# Altium project EVMOMAPL137_Orcad_revg.PrjPcb (part 2 of 4)

## Sheet SH21 - JTAG CONNECTOR.SchDoc
size 386 x 246 mm
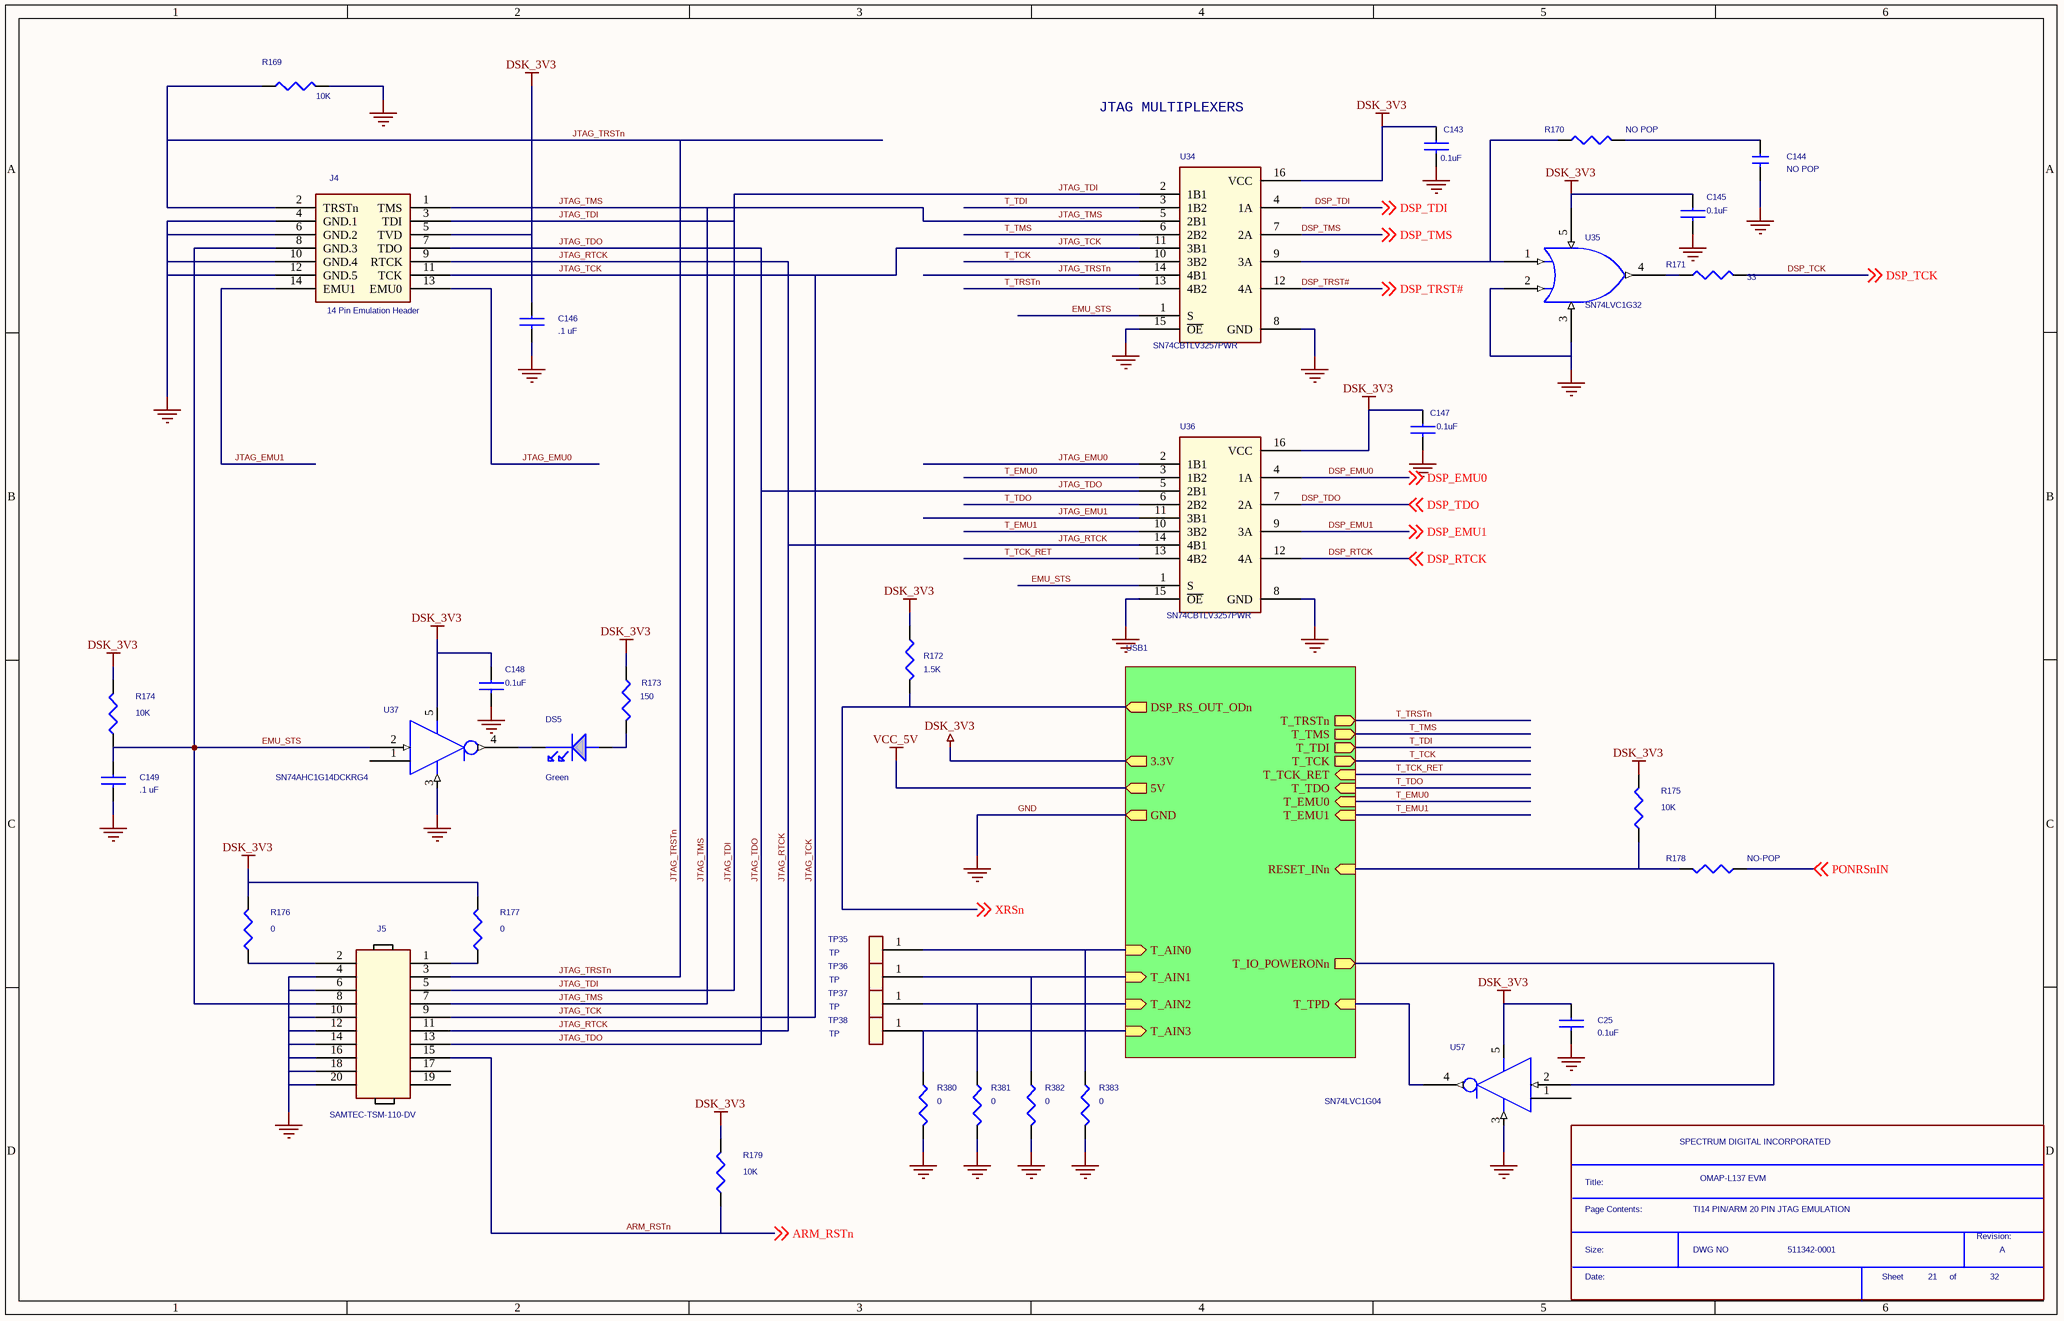
[diagram p11: SH21 - JTAG CONNECTOR.SchDoc]

### Parts
(Parts that share a designator on the sheet are numbered #1, #2 ... from top to bottom, then left to right.)
*#12  Page Contents:: TI14 PIN/ARM 20 PIN JTAG EMULATION  RevCode: A  Title: OMAP-L137 EVM  OrgName: SPECTRUM DIGITAL INCORPORATED  Doc: 511342-0001  Page Number: 21  Page Count: 32  (hidden comment: SDTitleBlock)  (graphical)
C25  0.1uF  [c402-25]
C143  0.1uF  [c402-25]
C144  NO POP  [c402-25]
C145  0.1uF  [c402-25]
C146  .1 uF  [c402-25]
C147  0.1uF  [c402-25]
C148  0.1uF  [c402-25]
C149  .1 uF  [c402-25]
DS5  Green  [CHIP 1206]
J4  14 Pin Emulation Header  [JUMP2X7-6040]
J5  SAMTEC-TSM-110-DV  [JUMP2X10-6040]
R169  10K  [r402-25]
R170  NO POP  [r603-35X45]
R171  33  [r402-25]
R172  1.5K  [r603-35x45]
R173  150  [r603-35x45]
R174  10K  [r402-25]
R175  10K  [r402-25]
R176  0  [r402-25]
R177  0  [r402-25]
R178  NO-POP  [r402-25]
R179  10K  [r402-25]
R380  0  [r402-25]
R381  0  [r402-25]
R382  0  [r402-25]
R383  0  [r402-25]
TP35  TP  [tp1-6040]
TP36  TP  [tp1-6040]
TP37  TP  [tp1-6040]
TP38  TP  [tp1-6040]
U34  SN74CBTLV3257PWR  [TSSOP 16]
U35  SN74LVC1G32  [SO5]
U36  SN74CBTLV3257PWR  [TSSOP 16]
U37  SN74AHC1G14DCKRG4  [DCK]
U57  SN74LVC1G04  [DCK]

### Sub-sheets
USB1 = ?: GND (out), 3.3V (out), T_TCK_RET (in), T_TCK (out), T_TMS (out), T_TDI (out), T_TDO (in), T_EMU0 (in), T_EMU1 (in), T_TRSTn (out), DSP_RS_OUT_ODn (out), RESET_INn (in), 5V (out), T_IO_POWERONn (out), T_TPD (in), T_AIN0 (in), T_AIN1 (in), T_AIN2 (in), T_AIN3 (in)

### Nets
DSK_3V3: C25.1 C143.1 C145.1 C146.1 C147.1 C148.1 J4.5(TVD) R172.1 R173.1 R174.2 R175.2 R176.2 R177.2 R179.2 U34.16(VCC) U35.5(VCC) U36.16(VCC) U37.5(VCC) U57.5(VCC) ; sheet USB1/3.3V
GND: C25.2 C143.2 C144.2 C145.2 C146.2 C147.2 C148.2 C149.2 J4.4(GND.1) J4.6(GND.2) J4.10(GND.4) J4.12(GND.5) J5.4 J5.6 J5.10 J5.12 J5.14 J5.16 J5.18 J5.20 R169.2 R380.2 R381.2 R382.2 R383.2 U34.8(GND) U34.15(~{OE}) U35.2(A) U35.3(GND) U36.8(GND) U36.15(~{OE}) U37.3(GND) U57.3(GND) ; sheet USB1/GND
ARM_RSTn: J5.15 R179.1 ; off-sheet ARM_RSTn
DSP_EMU0: U36.4(1A) ; off-sheet DSP_EMU0
DSP_EMU1: U36.9(3A) ; off-sheet DSP_EMU1
DSP_RTCK: U36.12(4A) ; off-sheet DSP_RTCK
DSP_TCK: R171.1 ; off-sheet DSP_TCK
DSP_TDI: U34.4(1A) ; off-sheet DSP_TDI
DSP_TDO: U36.7(2A) ; off-sheet DSP_TDO
DSP_TMS: U34.7(2A) ; off-sheet DSP_TMS
DSP_TRST#: U34.12(4A) ; off-sheet DSP_TRST#
EMU_STS: C149.1 J4.8(GND.3) J5.8 R174.1 U34.1(S) U36.1(S) U37.2(I)
JTAG_EMU0: J4.13(EMU0) U36.2(1B1)
JTAG_EMU1: J4.14(EMU1) U36.11(3B1)
JTAG_RTCK: J4.9(RTCK) J5.11 U36.14(4B1)
JTAG_TCK: J4.11(TCK) J5.9 U34.11(3B1)
JTAG_TDI: J4.3(TDI) J5.5 U34.2(1B1)
JTAG_TDO: J4.7(TDO) J5.13 U36.5(2B1)
JTAG_TMS: J4.1(TMS) J5.7 U34.5(2B1)
JTAG_TRSTn: J4.2(TRSTn) J5.3 R169.1 U34.14(4B1)
PONRSnIN: R178.1 ; off-sheet PONRSnIN
T_EMU0: U36.3(1B2) ; sheet USB1/T_EMU0
T_EMU1: U36.10(3B2) ; sheet USB1/T_EMU1
T_TCK: U34.10(3B2) ; sheet USB1/T_TCK
T_TCK_RET: U36.13(4B2) ; sheet USB1/T_TCK_RET
T_TDI: U34.3(1B2) ; sheet USB1/T_TDI
T_TDO: U36.6(2B2) ; sheet USB1/T_TDO
T_TMS: U34.6(2B2) ; sheet USB1/T_TMS
T_TRSTn: U34.13(4B2) ; sheet USB1/T_TRSTn
XRSn: R172.2 ; off-sheet XRSn, sheet USB1/DSP_RS_OUT_ODn
NetC144_1: C144.1 R170.2
NetDS5_1: DS5.1(CATHODE) U37.4(O)
NetDS5_2: DS5.2(ANODE) R173.2
NetJ5_1: J5.1 R177.1
NetJ5_2: J5.2 R176.1
NetR170_1: R170.1 U34.9(3A) U35.1(B)
NetR171_2: R171.2 U35.4(Y)
NetR175_1: R175.1 R178.2 ; sheet USB1/RESET_INn
NetR380_1: R380.1 TP38.1 ; sheet USB1/T_AIN3
NetR381_1: R381.1 TP37.1 ; sheet USB1/T_AIN2
NetR382_1: R382.1 TP36.1 ; sheet USB1/T_AIN1
NetR383_1: R383.1 TP35.1 ; sheet USB1/T_AIN0
NetU57_2: U57.2(I) ; sheet USB1/T_IO_POWERONn
NetU57_4: U57.4(O) ; sheet USB1/T_TPD

Not connected (* = marked no-connect by the designer): J5 17 19; U37 1; U57 1

### Notes on the sheet
- JTAG MULTIPLEXERS
- (in symbol SDTitleBlock) Title:; Page Contents:; Revision:; Size:; DWG NO; Date:; Sheet; of

### Library data of the parts
C25 = CAP NP: Part #: 101587-1100R
C143 C145 C147 C148 = CAP NP_0: Capacitor, Ceramic, 16V, X7R, 10%; Part #: 101587-1100R
C144 = CAP NP_1: Part #: C0402-NOPOP
C146 C149 = CAP NP_0: Part #: 101587-1100R
DS5 = LED_1: LED, Green, SMT; Part #: 100823-0001R
J4 = 14 Pin Emulation Header_1: Part #: 100116-0007R
J5 = HEADER 10X2: Part #: 100116-0010R; TN: 224-0183-000
R169 R174 R175 R179 = RESISTOR_1: Part #: 101370-1003R
R170 = R: Part #: R0603-NOPOP
R171 = R_1: Resistor, 5%, 1/16W; Part #: 101370-3300R
R172 = RESISTOR_1: Part #: 100642-1502R
R173 = R_1: Resistor, 5%, 1/16W; Part #: 100687-1501R
R176 R177 R380-R383 = R: Part #: 101370-0001R
R178 = RESISTOR_1: Part #: R0402-NOPOP
TP35-TP38 = TEST POINT: Part #: 100115-0001R
U34 U36 = SN74CBT3257_0: IC, Quad 2-1 Multiplexer; Part #: 101670-0001R
U35 = 1G032_0: Part #: 101057-0032R
U37 = SN74LVC1GU04_0: Single Schmitt-Trigger Inverter Gate; Part #: 101027-0001R
U57 = SN74LVC1GU04_0: Part #: 101057-0004R

## Sheet SH20 - SD_MMC.SchDoc
size 386 x 246 mm
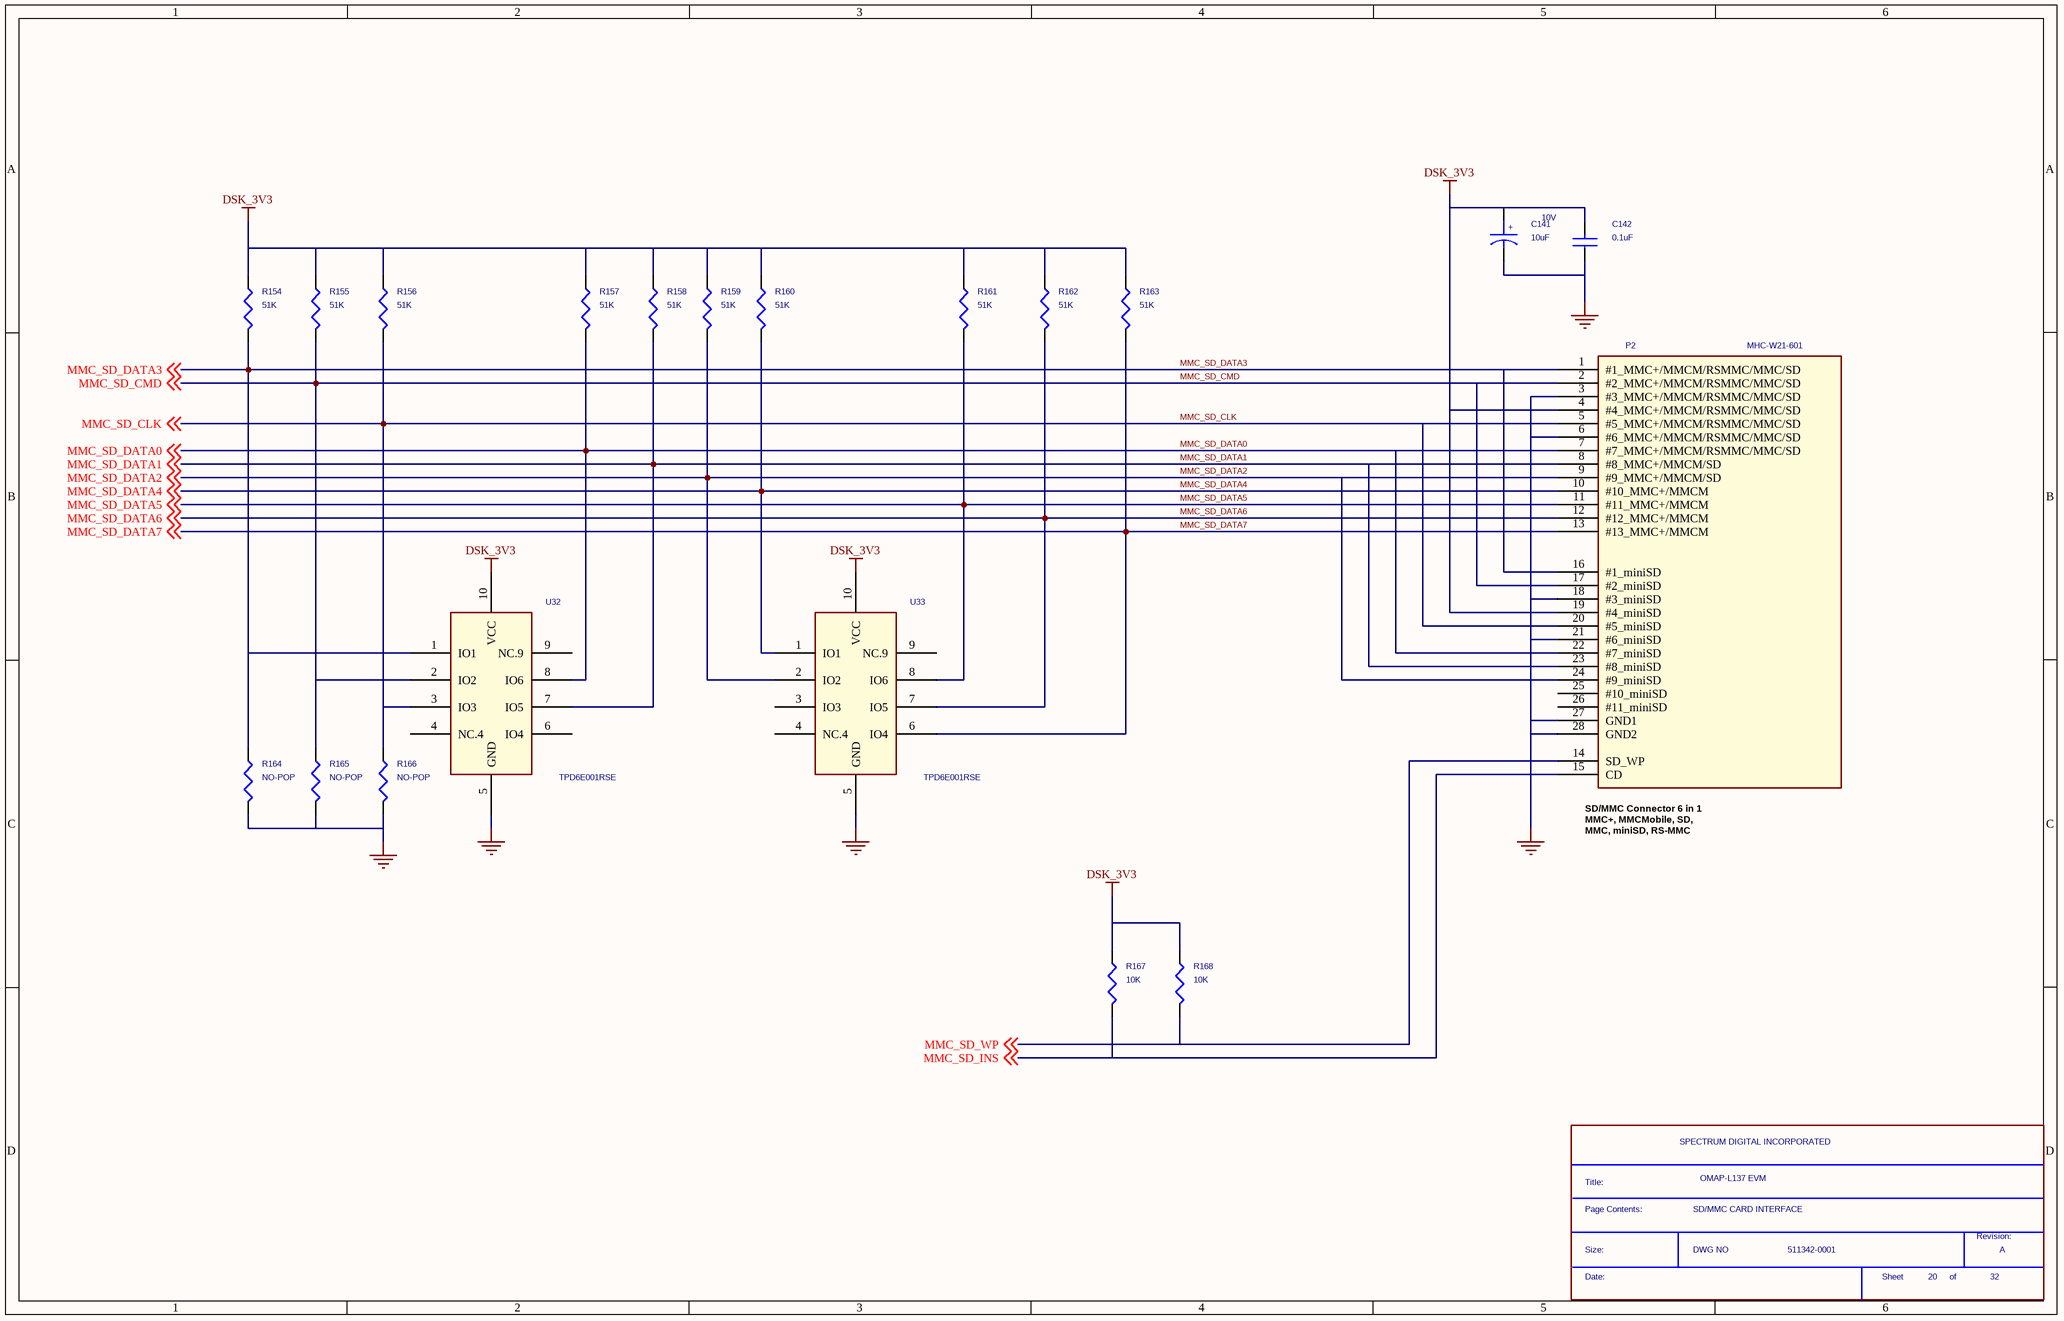
[diagram p12: SH20 - SD_MMC.SchDoc]

### Parts
(Parts that share a designator on the sheet are numbered #1, #2 ... from top to bottom, then left to right.)
*#13  Page Contents:: SD/MMC CARD INTERFACE  RevCode: A  Title: OMAP-L137 EVM  OrgName: SPECTRUM DIGITAL INCORPORATED  Doc: 511342-0001  Page Number: 20  Page Count: 32  (hidden comment: SDTitleBlock)  (graphical)
C141  10uF  [SM-PCAP-3216]
C142  0.1uF  Voltage: 10V  [SM-CAP-0402]
P2  MHC-W21-601  [SM-CON-MOLEX-54794-0918]
R154  51K  [r603-35X45]
R155  51K  [r603-35X45]
R156  51K  [r603-35X45]
R157  51K  [r603-35X45]
R158  51K  [r603-35X45]
R159  51K  [r603-35X45]
R160  51K  [r603-35X45]
R161  51K  [r603-35X45]
R162  51K  [r603-35X45]
R163  51K  [r603-35X45]
R164  NO-POP  [r402-25]
R165  NO-POP  [r402-25]
R166  NO-POP  [r402-25]
R167  10K  [SM-RES-0402]
R168  10K  [SM-RES-0402]
U32  TPD6E001RSE  [rse10]
U33  TPD6E001RSE  [rse10]

### Nets
DSK_3V3: C141.1(P) C142.2 P2.4(#4_MMC+/MMCM/RSMMC/MMC/SD) P2.19(#4_miniSD) R154.1 R155.1 R156.1 R157.1 R158.1 R159.1 R160.1 R161.1 R162.1 R163.1 R167.2(P2) R168.2(P2) U32.10(VCC) U33.10(VCC)
GND: C141.2(M) C142.1 P2.3(#3_MMC+/MMCM/RSMMC/MMC/SD) P2.6(#6_MMC+/MMCM/RSMMC/MMC/SD) P2.18(#3_miniSD) P2.21(#6_miniSD) P2.27(GND1) P2.28(GND2) R164.2 R165.2 R166.2 U32.5(GND) U33.5(GND)
MMC_SD_CLK: P2.5(#5_MMC+/MMCM/RSMMC/MMC/SD) P2.20(#5_miniSD) R156.2 R166.1 U32.3(IO3) ; off-sheet MMC_SD_CLK
MMC_SD_CMD: P2.2(#2_MMC+/MMCM/RSMMC/MMC/SD) P2.17(#2_miniSD) R155.2 R165.1 U32.2(IO2) ; off-sheet MMC_SD_CMD
MMC_SD_DATA0: P2.7(#7_MMC+/MMCM/RSMMC/MMC/SD) P2.22(#7_miniSD) R157.2 U32.8(IO6) ; off-sheet MMC_SD_DATA0
MMC_SD_DATA1: P2.8(#8_MMC+/MMCM/SD) P2.23(#8_miniSD) R158.2 U32.7(IO5) ; off-sheet MMC_SD_DATA1
MMC_SD_DATA2: P2.9(#9_MMC+/MMCM/SD) P2.24(#9_miniSD) R159.2 U33.2(IO2) ; off-sheet MMC_SD_DATA2
MMC_SD_DATA3: P2.1(#1_MMC+/MMCM/RSMMC/MMC/SD) P2.16(#1_miniSD) R154.2 R164.1 U32.1(IO1) ; off-sheet MMC_SD_DATA3
MMC_SD_DATA4: P2.10(#10_MMC+/MMCM) R160.2 U33.1(IO1) ; off-sheet MMC_SD_DATA4
MMC_SD_DATA5: P2.11(#11_MMC+/MMCM) R161.2 U33.8(IO6) ; off-sheet MMC_SD_DATA5
MMC_SD_DATA6: P2.12(#12_MMC+/MMCM) R162.2 U33.7(IO5) ; off-sheet MMC_SD_DATA6
MMC_SD_DATA7: P2.13(#13_MMC+/MMCM) R163.2 U33.6(IO4) ; off-sheet MMC_SD_DATA7
MMC_SD_INS: P2.15(CD) R167.1(P1) ; off-sheet MMC_SD_INS
MMC_SD_WP: P2.14(SD_WP) R168.1(P1) ; off-sheet MMC_SD_WP

Not connected (* = marked no-connect by the designer): P2 25(#10_miniSD) 26(#11_miniSD); U32 4(NC.4) 6(IO4) 9(NC.9); U33 3(IO3) 4(NC.4) 9(NC.9)

### Notes on the sheet
- (near P2) SD/MMC Connector 6 in 1
  MMC+, MMCMobile, SD,
  MMC, miniSD, RS-MMC
- (in symbol 10UF-10V-293D-C_1) +
- (in symbol SDTitleBlock) Title:; Page Contents:; Revision:; Size:; DWG NO; Date:; Sheet; of

### Library data of the parts
C141 = 10UF-10V-293D-C_1: Part #: 101003-0101R; CLASS: DISCRETE; DIS-V: RS; REF DIS-V: 100-2221; MAN: VISHAY-SPRAGUE; DES: 10UF,10V, Size B; PN: 293D106X9016C; RAT: 10V; PUR: SUB; TOL: 10%; TN: 208-0037-000
C142 = 0402_0r1uf_x7r_10v_10: Part #: 101587-1100R; TN: 207-0068-000; Desc: CAP, CER, X7R, 0402, 10V, 10%, 0.1uF
P2 = MMC4_2.0_CONN: Manufacturer: OMRON; Part #: 102710-0001R; ATLStockNo1: 4500.0144; TN: 224-0332-000
R154-R163 = R_1: Part #: 100687-5103R
R164-R166 = R_1: Part #: R0402-NOPOP
R167 R168 = RES_0: Part #: 101370-1003R; CLASS: DISCRETE; TN: 272-0029-000; TOL: 1%; RATING: 0.063W
U32 U33 = TPDE0001RSE: Part #: 102566-0001R

## Sheet SH19 - SD_MMC MUX.SchDoc
size 386 x 246 mm
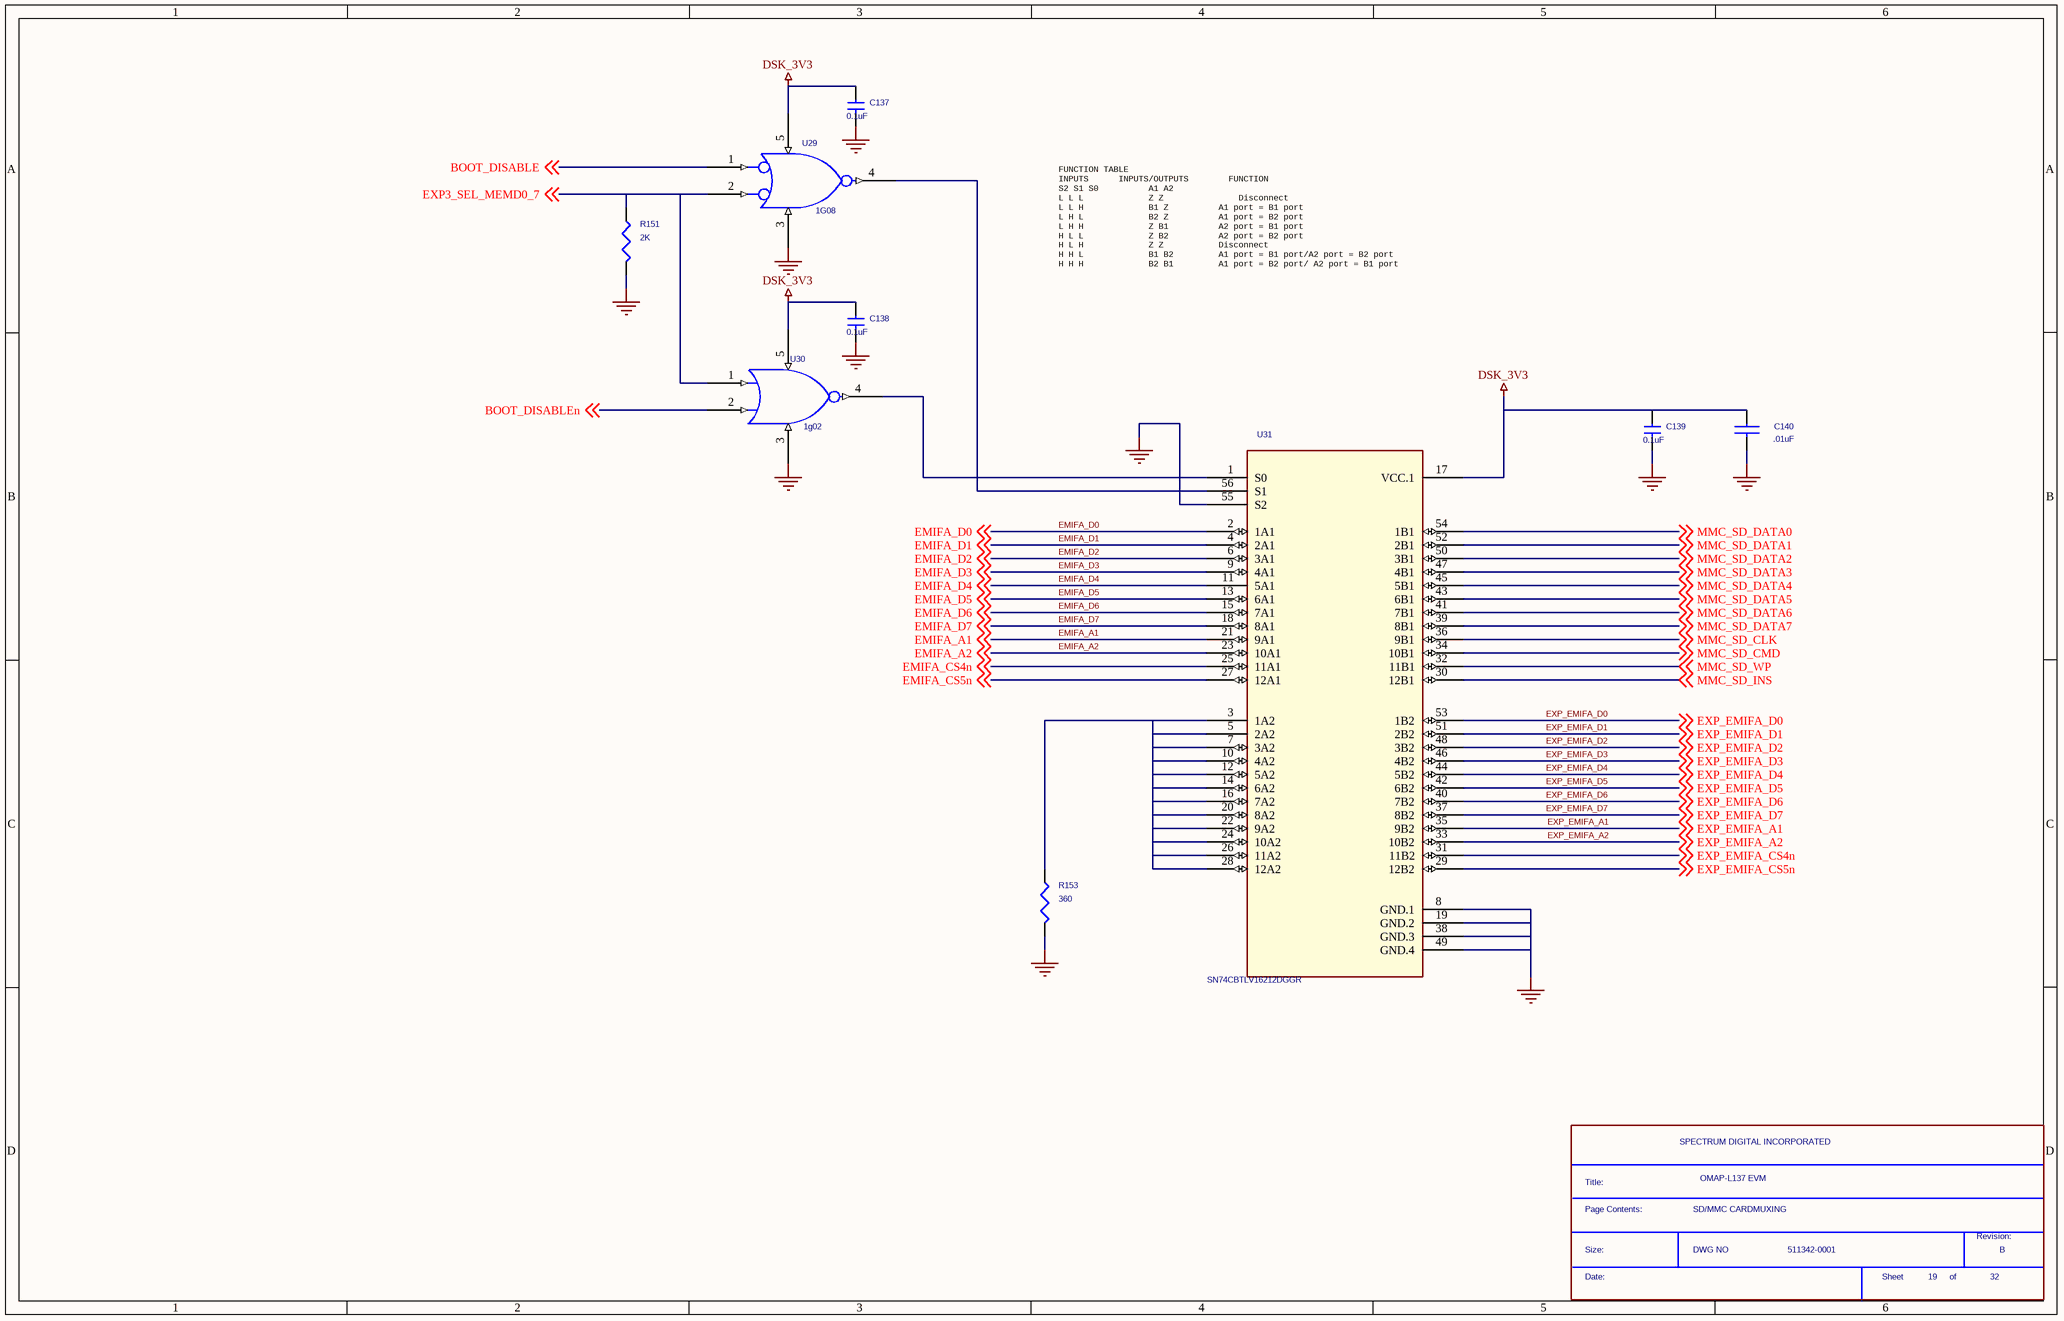
[diagram p13: SH19 - SD_MMC MUX.SchDoc]

### Parts
(Parts that share a designator on the sheet are numbered #1, #2 ... from top to bottom, then left to right.)
*#14  Page Contents:: SD/MMC CARDMUXING  RevCode: B  Title: OMAP-L137 EVM  OrgName: SPECTRUM DIGITAL INCORPORATED  Doc: 511342-0001  Page Number: 19  Page Count: 32  (hidden comment: SDTitleBlock)  (graphical)
C137  0.1uF  [c402-25]
C138  0.1uF  [c402-25]
C139  0.1uF  [c402-25]
C140  .01uF  [c402-25]
R151  2K  [r402-25]
R153  360  [r402-25]
U29  1G08  [SO5]
U30  1g02  [dck-5]
U31  SN74CBTLV16212DGGR  [56 pin TSSOP]

### Nets
DSK_3V3: C137.1 C138.1 C139.1 C140.1 U29.5(VCC) U30.5(VCC) U31.17(VCC.1)
GND: C137.2 C138.2 C139.2 C140.2 R151.2 R153.2 U29.3(GND) U30.3(GND) U31.8(GND.1) U31.19(GND.2) U31.38(GND.3) U31.49(GND.4) U31.55(S2)
BOOT_DISABLE: U29.1(B) ; off-sheet BOOT_DISABLE
BOOT_DISABLEn: U30.2(A) ; off-sheet BOOT_DISABLEn
EMIFA_A1: U31.21(9A1) ; off-sheet EMIFA_A1
EMIFA_A2: U31.23(10A1) ; off-sheet EMIFA_A2
EMIFA_CS4n: U31.25(11A1) ; off-sheet EMIFA_CS4n
EMIFA_CS5n: U31.27(12A1) ; off-sheet EMIFA_CS5n
EMIFA_D0: U31.2(1A1) ; off-sheet EMIFA_D0
EMIFA_D1: U31.4(2A1) ; off-sheet EMIFA_D1
EMIFA_D2: U31.6(3A1) ; off-sheet EMIFA_D2
EMIFA_D3: U31.9(4A1) ; off-sheet EMIFA_D3
EMIFA_D4: U31.11(5A1) ; off-sheet EMIFA_D4
EMIFA_D5: U31.13(6A1) ; off-sheet EMIFA_D5
EMIFA_D6: U31.15(7A1) ; off-sheet EMIFA_D6
EMIFA_D7: U31.18(8A1) ; off-sheet EMIFA_D7
EXP3_SEL_MEMD0_7: R151.1 U29.2(A) U30.1(B) ; off-sheet EXP3_SEL_MEMD0_7
EXP_EMIFA_A1: U31.35(9B2) ; off-sheet EXP_EMIFA_A1
EXP_EMIFA_A2: U31.33(10B2) ; off-sheet EXP_EMIFA_A2
EXP_EMIFA_CS4n: U31.31(11B2) ; off-sheet EXP_EMIFA_CS4n
EXP_EMIFA_CS5n: U31.29(12B2) ; off-sheet EXP_EMIFA_CS5n
EXP_EMIFA_D0: U31.53(1B2) ; off-sheet EXP_EMIFA_D0
EXP_EMIFA_D1: U31.51(2B2) ; off-sheet EXP_EMIFA_D1
EXP_EMIFA_D2: U31.48(3B2) ; off-sheet EXP_EMIFA_D2
EXP_EMIFA_D3: U31.46(4B2) ; off-sheet EXP_EMIFA_D3
EXP_EMIFA_D4: U31.44(5B2) ; off-sheet EXP_EMIFA_D4
EXP_EMIFA_D5: U31.42(6B2) ; off-sheet EXP_EMIFA_D5
EXP_EMIFA_D6: U31.40(7B2) ; off-sheet EXP_EMIFA_D6
EXP_EMIFA_D7: U31.37(8B2) ; off-sheet EXP_EMIFA_D7
MMC_SD_CLK: U31.36(9B1) ; off-sheet MMC_SD_CLK
MMC_SD_CMD: U31.34(10B1) ; off-sheet MMC_SD_CMD
MMC_SD_DATA0: U31.54(1B1) ; off-sheet MMC_SD_DATA0
MMC_SD_DATA1: U31.52(2B1) ; off-sheet MMC_SD_DATA1
MMC_SD_DATA2: U31.50(3B1) ; off-sheet MMC_SD_DATA2
MMC_SD_DATA3: U31.47(4B1) ; off-sheet MMC_SD_DATA3
MMC_SD_DATA4: U31.45(5B1) ; off-sheet MMC_SD_DATA4
MMC_SD_DATA5: U31.43(6B1) ; off-sheet MMC_SD_DATA5
MMC_SD_DATA6: U31.41(7B1) ; off-sheet MMC_SD_DATA6
MMC_SD_DATA7: U31.39(8B1) ; off-sheet MMC_SD_DATA7
MMC_SD_INS: U31.30(12B1) ; off-sheet MMC_SD_INS
MMC_SD_WP: U31.32(11B1) ; off-sheet MMC_SD_WP
NetR153_1: R153.1 U31.3(1A2) U31.5(2A2) U31.7(3A2) U31.10(4A2) U31.12(5A2) U31.14(6A2) U31.16(7A2) U31.20(8A2) U31.22(9A2) U31.24(10A2) U31.26(11A2) U31.28(12A2)
NetU29_4: U29.4(Y) U31.56(S1)
NetU30_4: U30.4(Y) U31.1(S0)

### Notes on the sheet
- FUNCTION TABLE
  INPUTS      INPUTS/OUTPUTS        FUNCTION
  S2 S1 S0          A1 A2
  L L L             Z Z               Disconnect
  L L H             B1 Z          A1 port = B1 port
  L H L             B2 Z          A1 port = B2 port
  L H H             Z B1          A2 port = B1 port
  H L L             Z B2          A2 port = B2 port
  H L H             Z Z           Disconnect
  H H L             B1 B2         A1 port = B1 port/A2 port = B2 port
  H H H             B2 B1         A1 port = B2 port/ A2 port = B1 port
- (in symbol SDTitleBlock) Title:; Page Contents:; Revision:; Size:; DWG NO; Date:; Sheet; of

### Library data of the parts
C137-C139 = CAP NP_1: Part #: 101587-1100R
C140 = CAP NP_0: Part #: 101587-1101R
R151 = R: Part #: 101370-2002R
R153 = R: Part #: 101370-3601R
U29 = 1G08: Part #: 101057-0008R
U30 = 1g02_0: Part #: 101057-0002R
U31 = SN74CBT16212DGGR: Part #: 102693-0001R; SD PCB Footprint: TSSOP56

## Sheet SH18 -  RS232.SchDoc
size 386 x 246 mm
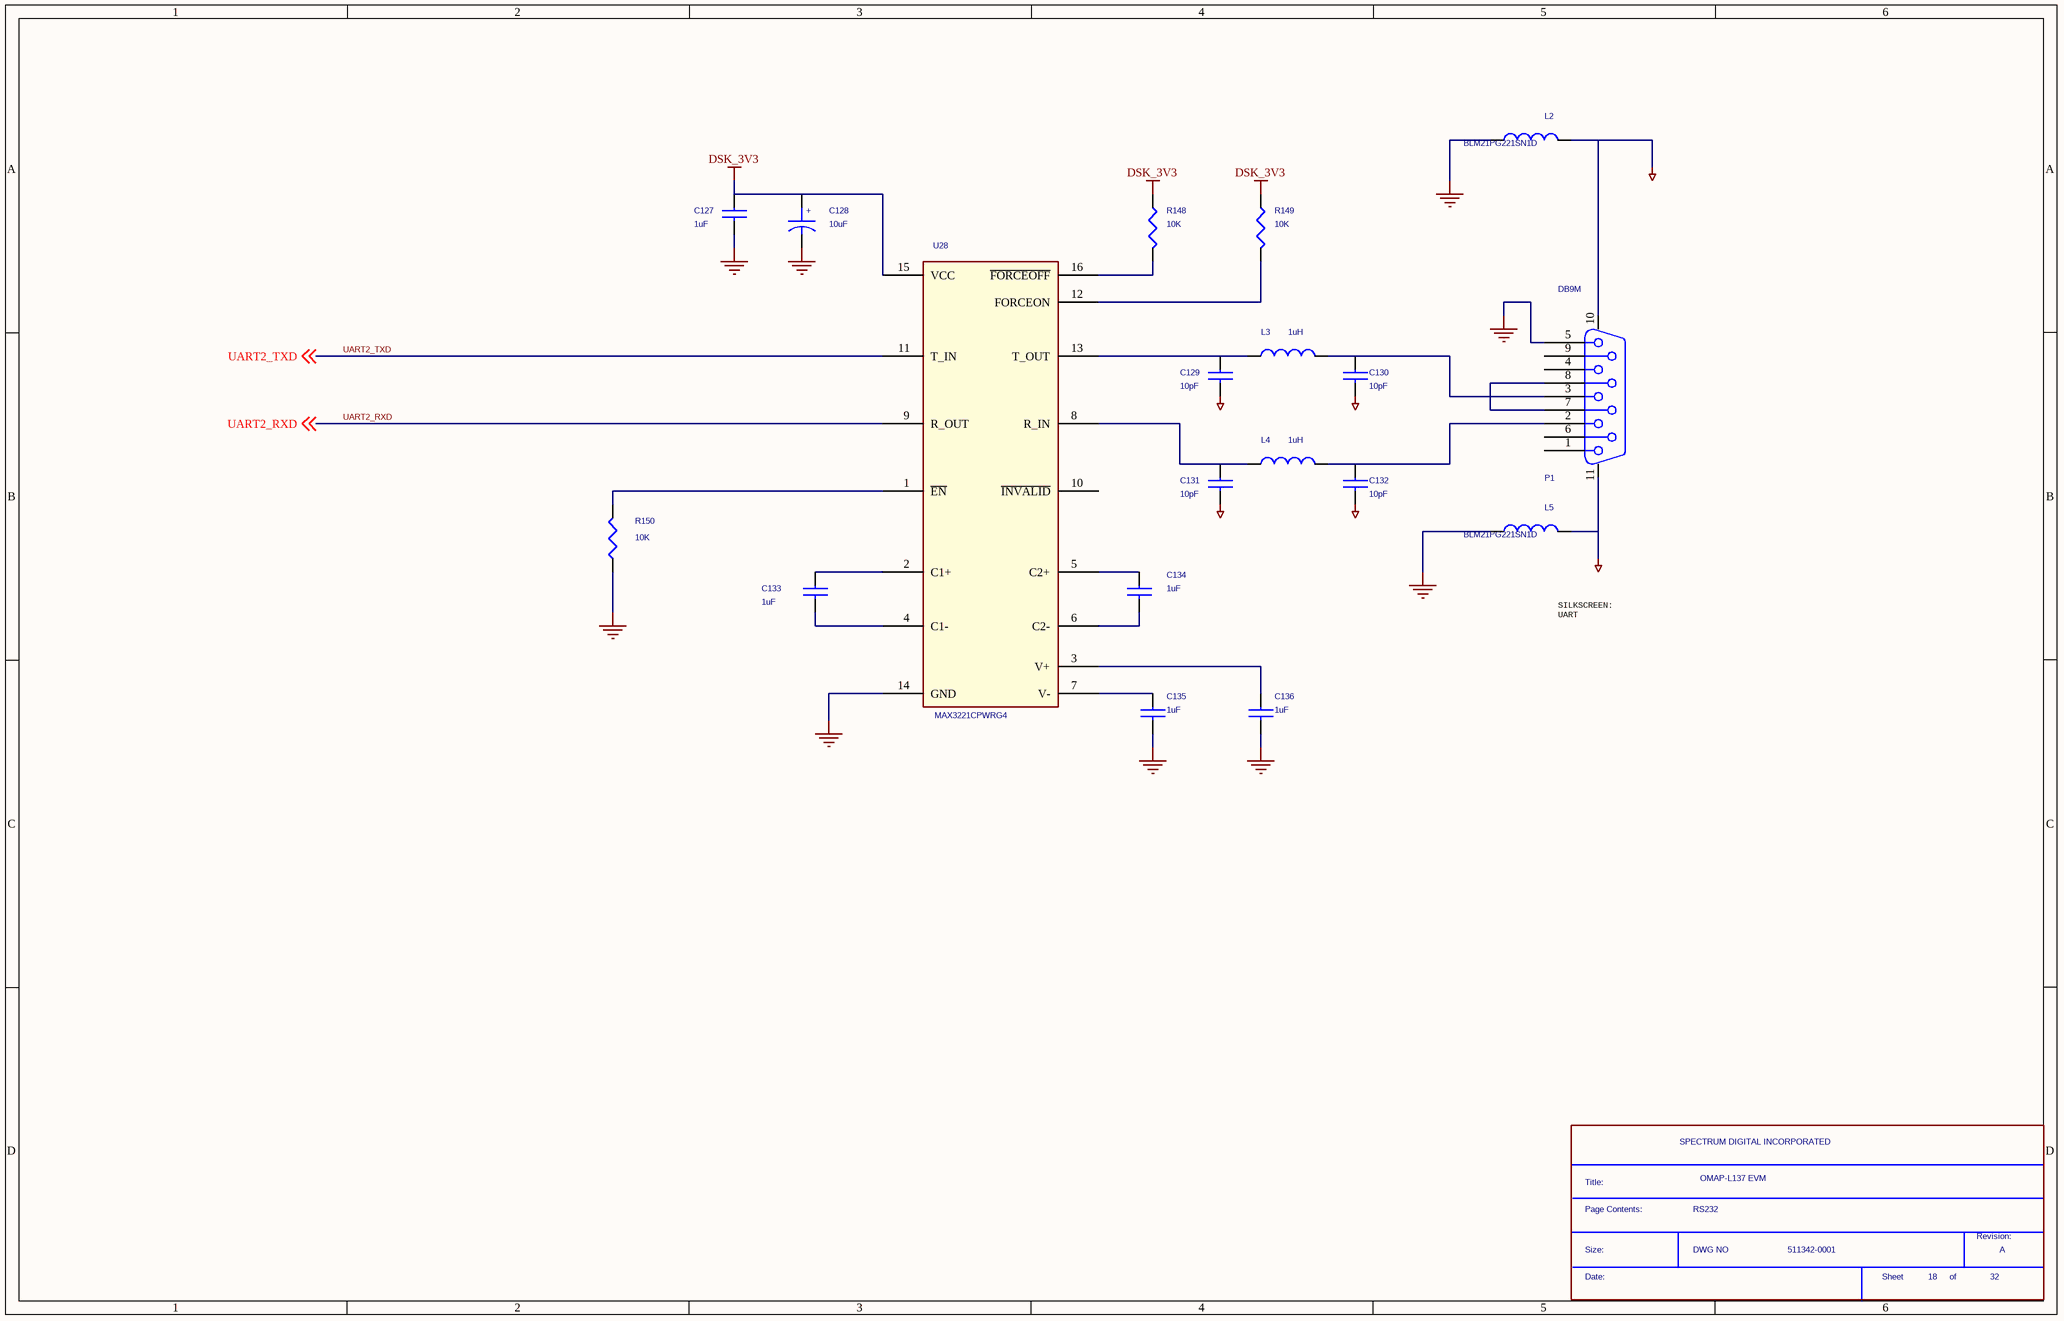
[diagram p14: SH18 -  RS232.SchDoc]

### Parts
(Parts that share a designator on the sheet are numbered #1, #2 ... from top to bottom, then left to right.)
*#15  Page Contents:: RS232  RevCode: A  Title: OMAP-L137 EVM  OrgName: SPECTRUM DIGITAL INCORPORATED  Doc: 511342-0001  Page Number: 18  Page Count: 32  (hidden comment: SDTitleBlock)  (graphical)
C127  1uF  [c603-35x45]
C128  10uF  [c1206-40x70-POL]
C129  10pF  [c603-35x45]
C130  10pF  [c603-35x45]
C131  10pF  [c603-35x45]
C132  10pF  [c603-35x45]
C133  1uF  [c603-35x45]
C134  1uF  [c603-35x45]
C135  1uF  [c603-35x45]
C136  1uF  [c603-35x45]
L2  BLM21PG221SN1D  [l805-35x60]
L3  1uH  [L805-35x60]
L4  1uH  [L805-35x60]
L5  BLM21PG221SN1D  [l805-35x60]
P1  DB9M  [DSUB-9-M]
R148  10K  [r402-25]
R149  10K  [r402-25]
R150  10K  [r402-25]
U28  MAX3221CPWRG4  [pw16-14x70]

### Nets
DSK_3V3: C127.1 C128.1 R148.1 R149.1 U28.15(VCC)
GND: C127.2 C128.2 C135.2 C136.2 L2.1 L5.1 P1.5 R150.1 U28.14(GND)
GND_E_RS232: C129.2 C130.2 C131.2 C132.2 L2.2 L5.2 P1.10 P1.11
UART2_RXD: U28.9(R_OUT) ; off-sheet UART2_RXD
UART2_TXD: U28.11(T_IN) ; off-sheet UART2_TXD
NetC129_1: C129.1 L3.1 U28.13(T_OUT)
NetC130_1: C130.1 L3.2 P1.3
NetC131_1: C131.1 L4.1 U28.8(R_IN)
NetC132_1: C132.1 L4.2 P1.2
NetC133_1: C133.1 U28.2(C1+)
NetC133_2: C133.2 U28.4(C1-)
NetC134_1: C134.1 U28.5(C2+)
NetC134_2: C134.2 U28.6(C2-)
NetC135_1: C135.1 U28.7(V-)
NetC136_1: C136.1 U28.3(V+)
NetP1_7: P1.7 P1.8
NetR148_2: R148.2 U28.16(~{FORCEOFF})
NetR149_2: R149.2 U28.12(FORCEON)
NetR150_2: R150.2 U28.1(~{EN})

Not connected (* = marked no-connect by the designer): P1 1 4 6 9; U28 10(~{INVALID})

### Notes on the sheet
- SILKSCREEN:
  UART
- (in symbol CAPACITOR POL_0) +
- (in symbol SDTitleBlock) Title:; Page Contents:; Revision:; Size:; DWG NO; Date:; Sheet; of

### Library data of the parts
C127 C133-C136 = CAP NP: Part #: 101007-0100R
C128 = CAPACITOR POL_0: Part #: 101003-0101R; Buy: D/K P#335 P2032-ND
C129-C132 = CAP NP: Part #: 101001-1104R
L2 L5 = INDUCTOR_0: Part #: 101228-2201R; Part Number: BLM21PG221SN1D
L3 L4 = INDUCTOR: Part #: 101584-0100R
P1 = DSUB9-Male: Part #: 100558-0009R; ATLStockNo1: 4500.xxxx; SD PCB Footprint: db9mrg
R148-R150 = RESISTOR: Part #: 101370-1003R
U28 = MAX3221_0: Part #: 101691-0001R

## Sheet SH17 - USER SWITCHES_LE.SchDoc
size 386 x 246 mm
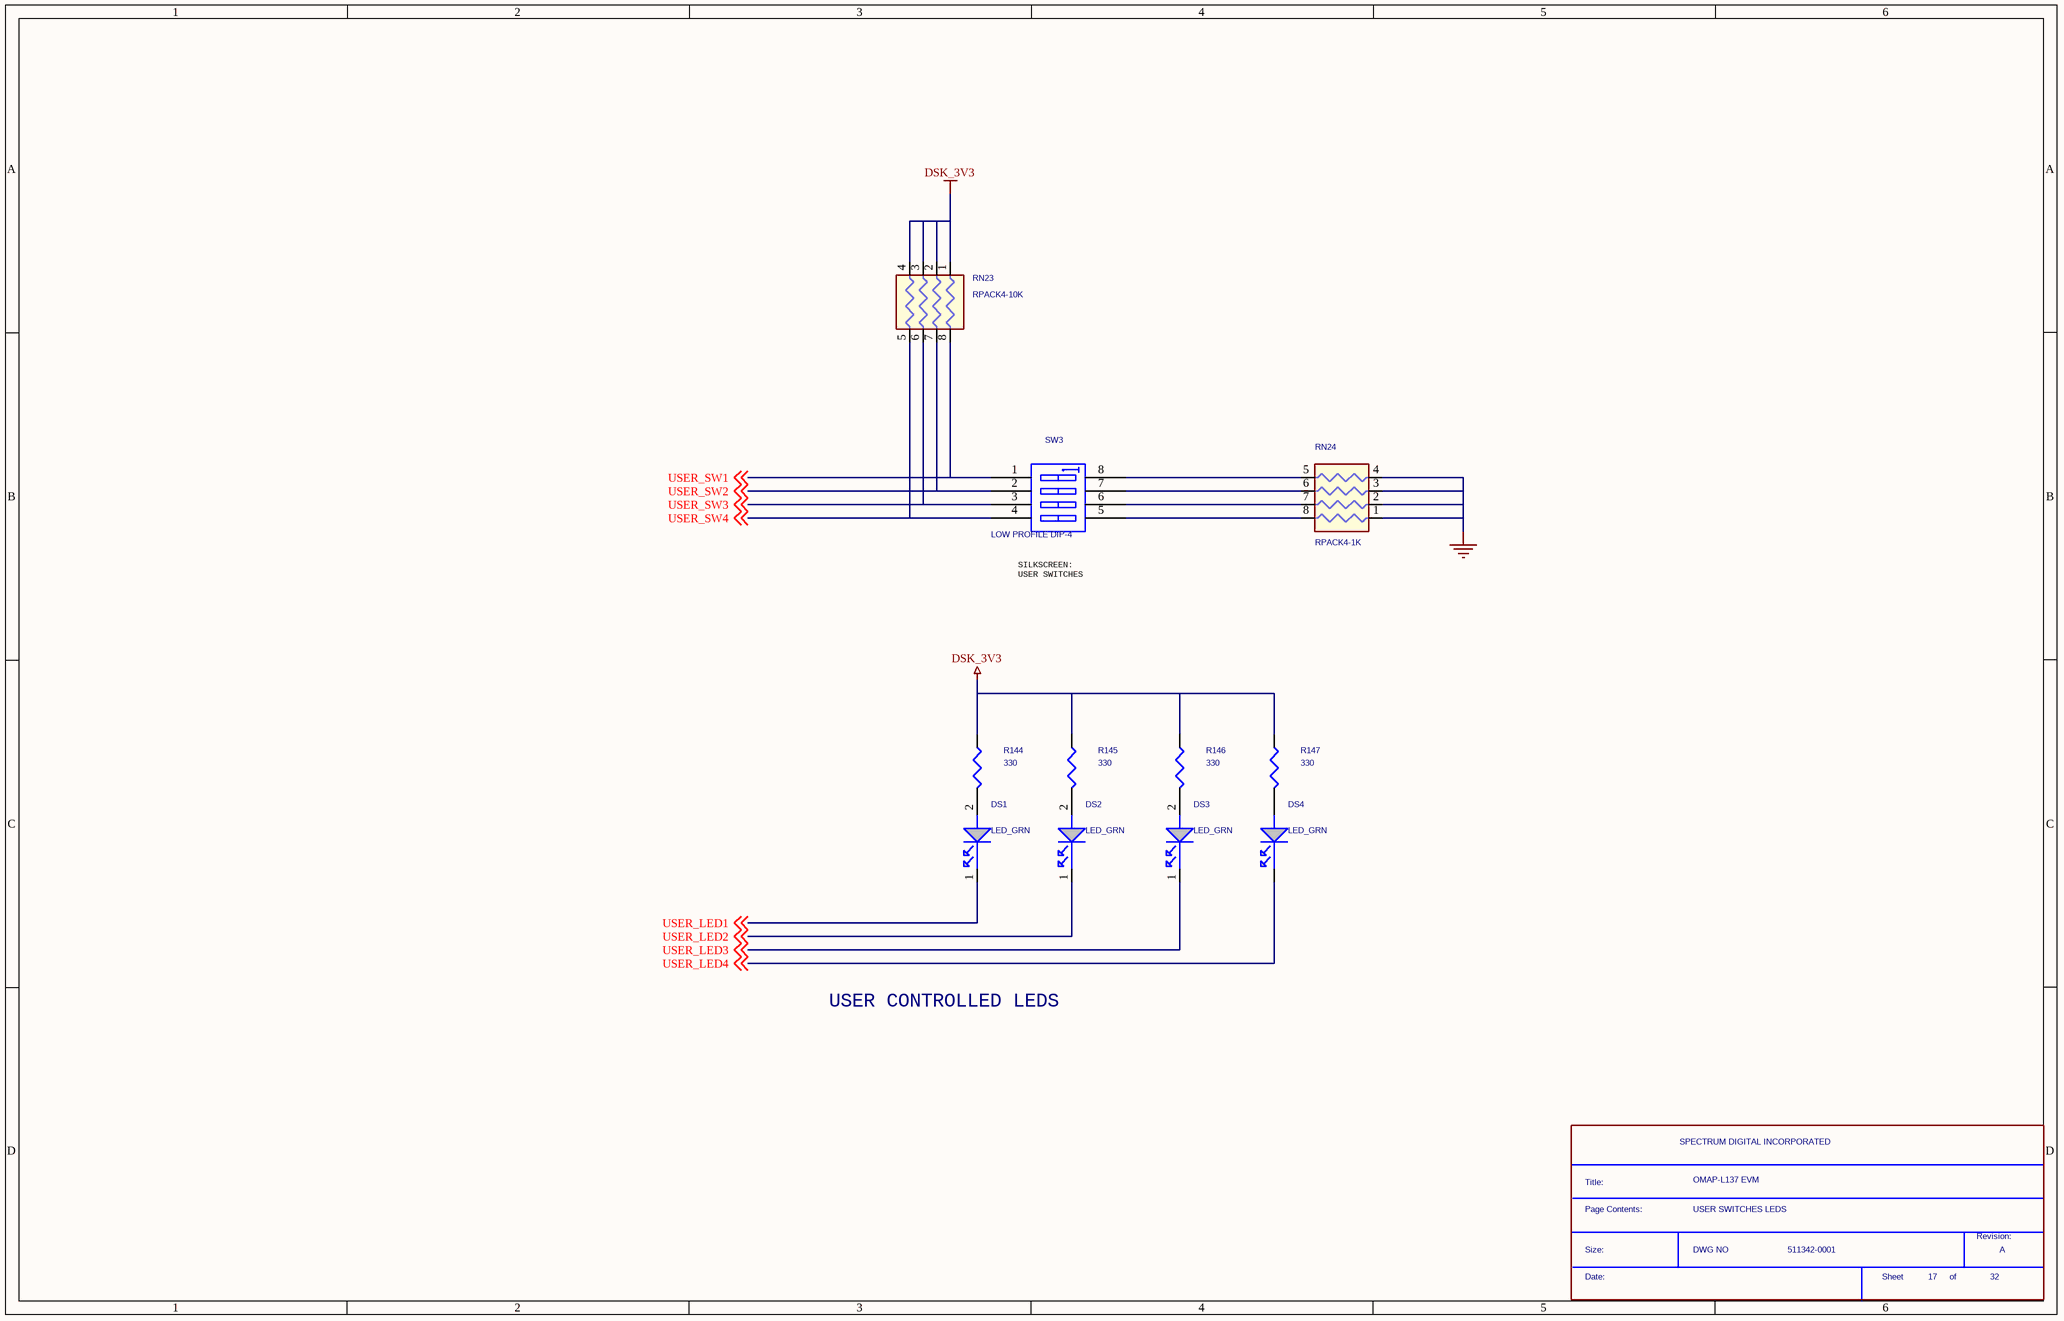
[diagram p15: SH17 - USER SWITCHES_LE.SchDoc]

### Parts
(Parts that share a designator on the sheet are numbered #1, #2 ... from top to bottom, then left to right.)
*#16  Page Contents:: USER SWITCHES LEDS  RevCode: A  Title: OMAP-L137 EVM  OrgName: SPECTRUM DIGITAL INCORPORATED  Doc: 511342-0001  Page Number: 17  Page Count: 32  (hidden comment: SDTitleBlock)  (graphical)
DS1  LED_GRN  [led1206-59x59]
DS2  LED_GRN  [led1206-59x59]
DS3  LED_GRN  [led1206-59x59]
DS4  LED_GRN  [led1206-59x59]
R144  330  [r402-25]
R145  330  [r402-25]
R146  330  [r402-25]
R147  330  [r402-25]
RN23  RPACK4-10K  [rpak8-10x25-28v]
RN24  RPACK4-1K  [rpak8-10x25-28v]
SW3  LOW PROFILE DIP-4  [sw4-44x96-cts]

### Nets
DSK_3V3: R144.1 R145.1 R146.1 R147.1 RN23.1(R1A) RN23.2(R2A) RN23.3(R3A) RN23.4(R4A)
GND: RN24.1(R1A) RN24.2(R2A) RN24.3(R3A) RN24.4(R4A)
USER_LED1: DS1.1(CATHODE) ; off-sheet USER_LED1
USER_LED2: DS2.1(CATHODE) ; off-sheet USER_LED2
USER_LED3: DS3.1(CATHODE) ; off-sheet USER_LED3
USER_LED4: DS4.1(cathode) ; off-sheet USER_LED4
USER_SW1: RN23.8(R1B) SW3.1(A1) ; off-sheet USER_SW1
USER_SW2: RN23.7(R2B) SW3.2(A2) ; off-sheet USER_SW2
USER_SW3: RN23.6(R3B) SW3.3(A3) ; off-sheet USER_SW3
USER_SW4: RN23.5(R4B) SW3.4(A4) ; off-sheet USER_SW4
NetDS1_2: DS1.2(ANODE) R144.2
NetDS2_2: DS2.2(ANODE) R145.2
NetDS3_2: DS3.2(ANODE) R146.2
NetDS4_2: DS4.2(ANODE) R147.2
NetRN24_5: RN24.5(R4B) SW3.8(B1)
NetRN24_6: RN24.6(R3B) SW3.7(B2)
NetRN24_7: RN24.7(R2B) SW3.6(B3)
NetRN24_8: RN24.8(R1B) SW3.5(B4)

### Notes on the sheet
- (near SW3) SILKSCREEN:
  USER SWITCHES
- USER CONTROLLED LEDS
- (in symbol SDTitleBlock) Title:; Page Contents:; Revision:; Size:; DWG NO; Date:; Sheet; of

### Library data of the parts
DS1-DS3 = LED_0: LEDs (green); Part #: 100823-0001R; Mfgr Nbr: LTST-C150GKT; Mfgr: Lite-on
DS4 = LED_RED_0: LEDs (green); Part #: 100823-0001R; Mfgr: Lite-on; Mfgr Nbr: LTST-C150GKT
R144-R147 = R_0: Part #: 101370-3301R
RN23 = R-Pak4: Part #: 101327-1003R
RN24 = R-Pak4: Part #: 101327-1002R
SW3 = SW DIP-4_0: Part #: 100584-0004R

## Sheet SH16 - SPI ROM.SchDoc
size 386 x 246 mm
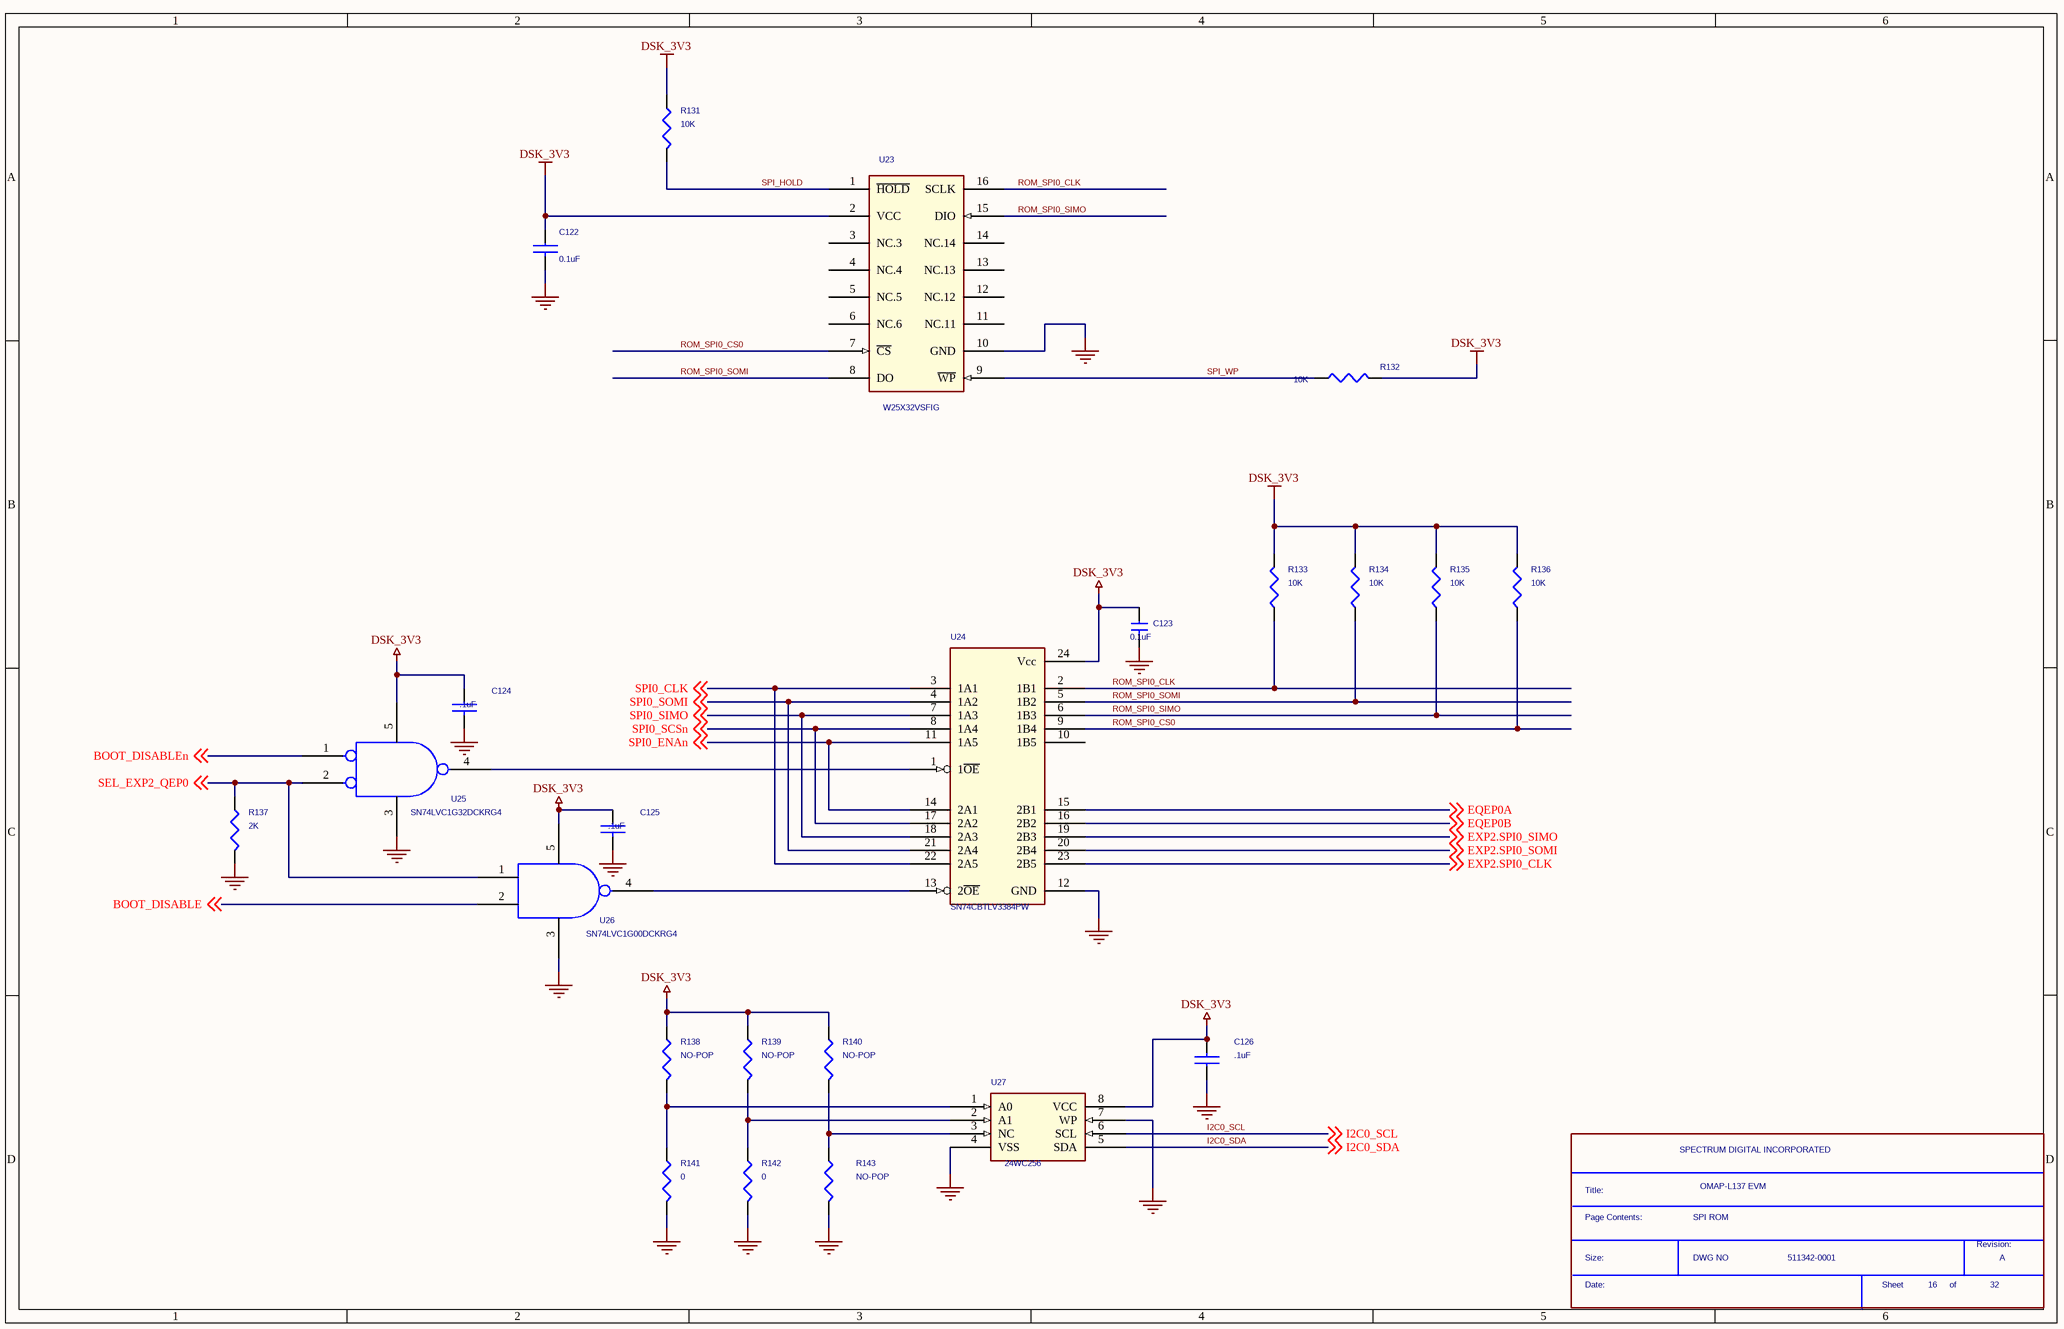
[diagram p16: SH16 - SPI ROM.SchDoc]

### Parts
(Parts that share a designator on the sheet are numbered #1, #2 ... from top to bottom, then left to right.)
*#17  Page Contents:: SPI ROM  RevCode: A  Title: OMAP-L137 EVM  OrgName: SPECTRUM DIGITAL INCORPORATED  Doc: 511342-0001  Page Number: 16  Page Count: 32  (hidden comment: SDTitleBlock)  (graphical)
C122  0.1uF  [c402-25]
C123  0.1uF  [c402-25]
C124  .1uF  [c402-25]
C125  .1uF  [c402-25]
C126  .1uF  [C0603]
R131  10K  [r402-25]
R132  10K  [r402-25]
R133  10K  [r402-25]
R134  10K  [r402-25]
R135  10K  [r402-25]
R136  10K  [r402-25]
R137  2K  [r402-25]
R138  NO-POP  [r402-25]
R139  NO-POP  [r402-25]
R140  NO-POP  [r402-25]
R141  0  [r402-25]
R142  0  [r402-25]
R143  NO-POP  [r402-25]
U23  W25X32VSFIG  [so16-25x75-300]
U24  SN74CBTLV3384PW  [TSSOP-24]
U25  SN74LVC1G32DCKRG4  [dck-5]
U26  SN74LVC1G00DCKRG4  [dck-5]
U27  24WC256  [SOIC]

### Nets
DSK_3V3: C122.1 C123.1 C124.1 C125.1 C126.2 R131.1 R132.1 R133.2 R134.2 R135.2 R136.2 R138.1 R139.1 R140.1 U23.2(VCC) U24.24(Vcc) U25.5(VCC) U26.5(VCC) U27.8(VCC)
GND: C122.2 C123.2 C124.2 C125.2 C126.1 R137.2 R141.2 R142.2 R143.2 U23.10(GND) U24.12(GND) U25.3(GND) U26.3(GND) U27.4(VSS) U27.7(WP)
BOOT_DISABLE: U26.2(B) ; off-sheet BOOT_DISABLE
BOOT_DISABLEn: U25.1(A) ; off-sheet BOOT_DISABLEn
EQEP0A: U24.15(2B1) ; off-sheet EQEP0A
EQEP0B: U24.16(2B2) ; off-sheet EQEP0B
EXP2.SPI0_CLK: U24.23(2B5) ; off-sheet EXP2.SPI0_CLK
EXP2.SPI0_SIMO: U24.19(2B3) ; off-sheet EXP2.SPI0_SIMO
EXP2.SPI0_SOMI: U24.20(2B4) ; off-sheet EXP2.SPI0_SOMI
I2C0_SCL: U27.6(SCL) ; off-sheet I2C0_SCL
I2C0_SDA: U27.5(SDA) ; off-sheet I2C0_SDA
ROM_SPI0_CLK: R133.1 U23.16(SCLK) U24.2(1B1)
ROM_SPI0_CS0: R136.1 U23.7(~{CS}) U24.9(1B4)
ROM_SPI0_SIMO: R135.1 U23.15(DIO) U24.6(1B3)
ROM_SPI0_SOMI: R134.1 U23.8(DO) U24.5(1B2)
SEL_EXP2_QEP0: R137.1 U25.2(B) U26.1(A) ; off-sheet SEL_EXP2_QEP0
SPI0_CLK: U24.3(1A1) U24.22(2A5) ; off-sheet SPI0_CLK  [project net BOOTMODE[2]]
SPI0_ENAn: U24.11(1A5) U24.14(2A1) ; off-sheet SPI0_ENAn  [project net BOOTMODE[3]]
SPI0_SCSn: U24.8(1A4) U24.17(2A2) ; off-sheet SPI0_SCSn
SPI0_SIMO: U24.7(1A3) U24.18(2A3) ; off-sheet SPI0_SIMO  [project net BOOTMODE[1]]
SPI0_SOMI: U24.4(1A2) U24.21(2A4) ; off-sheet SPI0_SOMI  [project net BOOTMODE[0]]
SPI_HOLD: R131.2 U23.1(~{HOLD})
SPI_WP: R132.2 U23.9(~{WP})
NetR138_2: R138.2 R141.1 U27.1(A0)
NetR139_2: R139.2 R142.1 U27.2(A1)
NetR140_2: R140.2 R143.1 U27.3(NC)
NetU24_1: U24.1(1~{OE}) U25.4(Y)
NetU24_13: U24.13(2~{OE}) U26.4(Y)

Not connected (* = marked no-connect by the designer): U23 3(NC.3) 4(NC.4) 5(NC.5) 6(NC.6) 11(NC.11) 12(NC.12) 13(NC.13) 14(NC.14); U24 10(1B5)

### Notes on the sheet
- (in symbol SDTitleBlock) Title:; Page Contents:; Revision:; Size:; DWG NO; Date:; Sheet; of

### Library data of the parts
C122 = CAP NP: Part #: 101587-1100R
C123 = CAP NP_1: Part #: 101587-1100R
C124 C125 = CAP NP_2: Part #: 101587-1100R
C126 = CAP .1 uF 10% 0603: Part #: 101587-1100R; SD PCB Footprint: EIA0603
R131 = R: Part #: 101370-1003R
R132-R136 = RESISTOR_1: Part #: 101370-1003R
R137 = R: Part #: 101370-2002R
R138-R140 R143 = R: Part #: R0402-NOPOP
R141 R142 = R_1: Part #: 101370-0001R; SD PCB Footprint: EIA0603
U23 = SPI_EEPROM_0: Part #: 102801-0001R
U24 = SN74CBTD3384PW: IC, Quad 2-to-1 Mux with Level Conversion; Part #: 101679-0001R; Mfg: TI
U25 = 1g32neg: Part #: 101057-0032R
U26 = 1g00_0: Part #: 101057-0001R
U27 = 24WC256: 256K-Bit I 2 C Serial CMOS EEPROM; Part #: 102235-0001R; SD PCB Footprint: SO8W

## Sheet SH15 - SDRAM EMIF B.SchDoc
size 386 x 246 mm
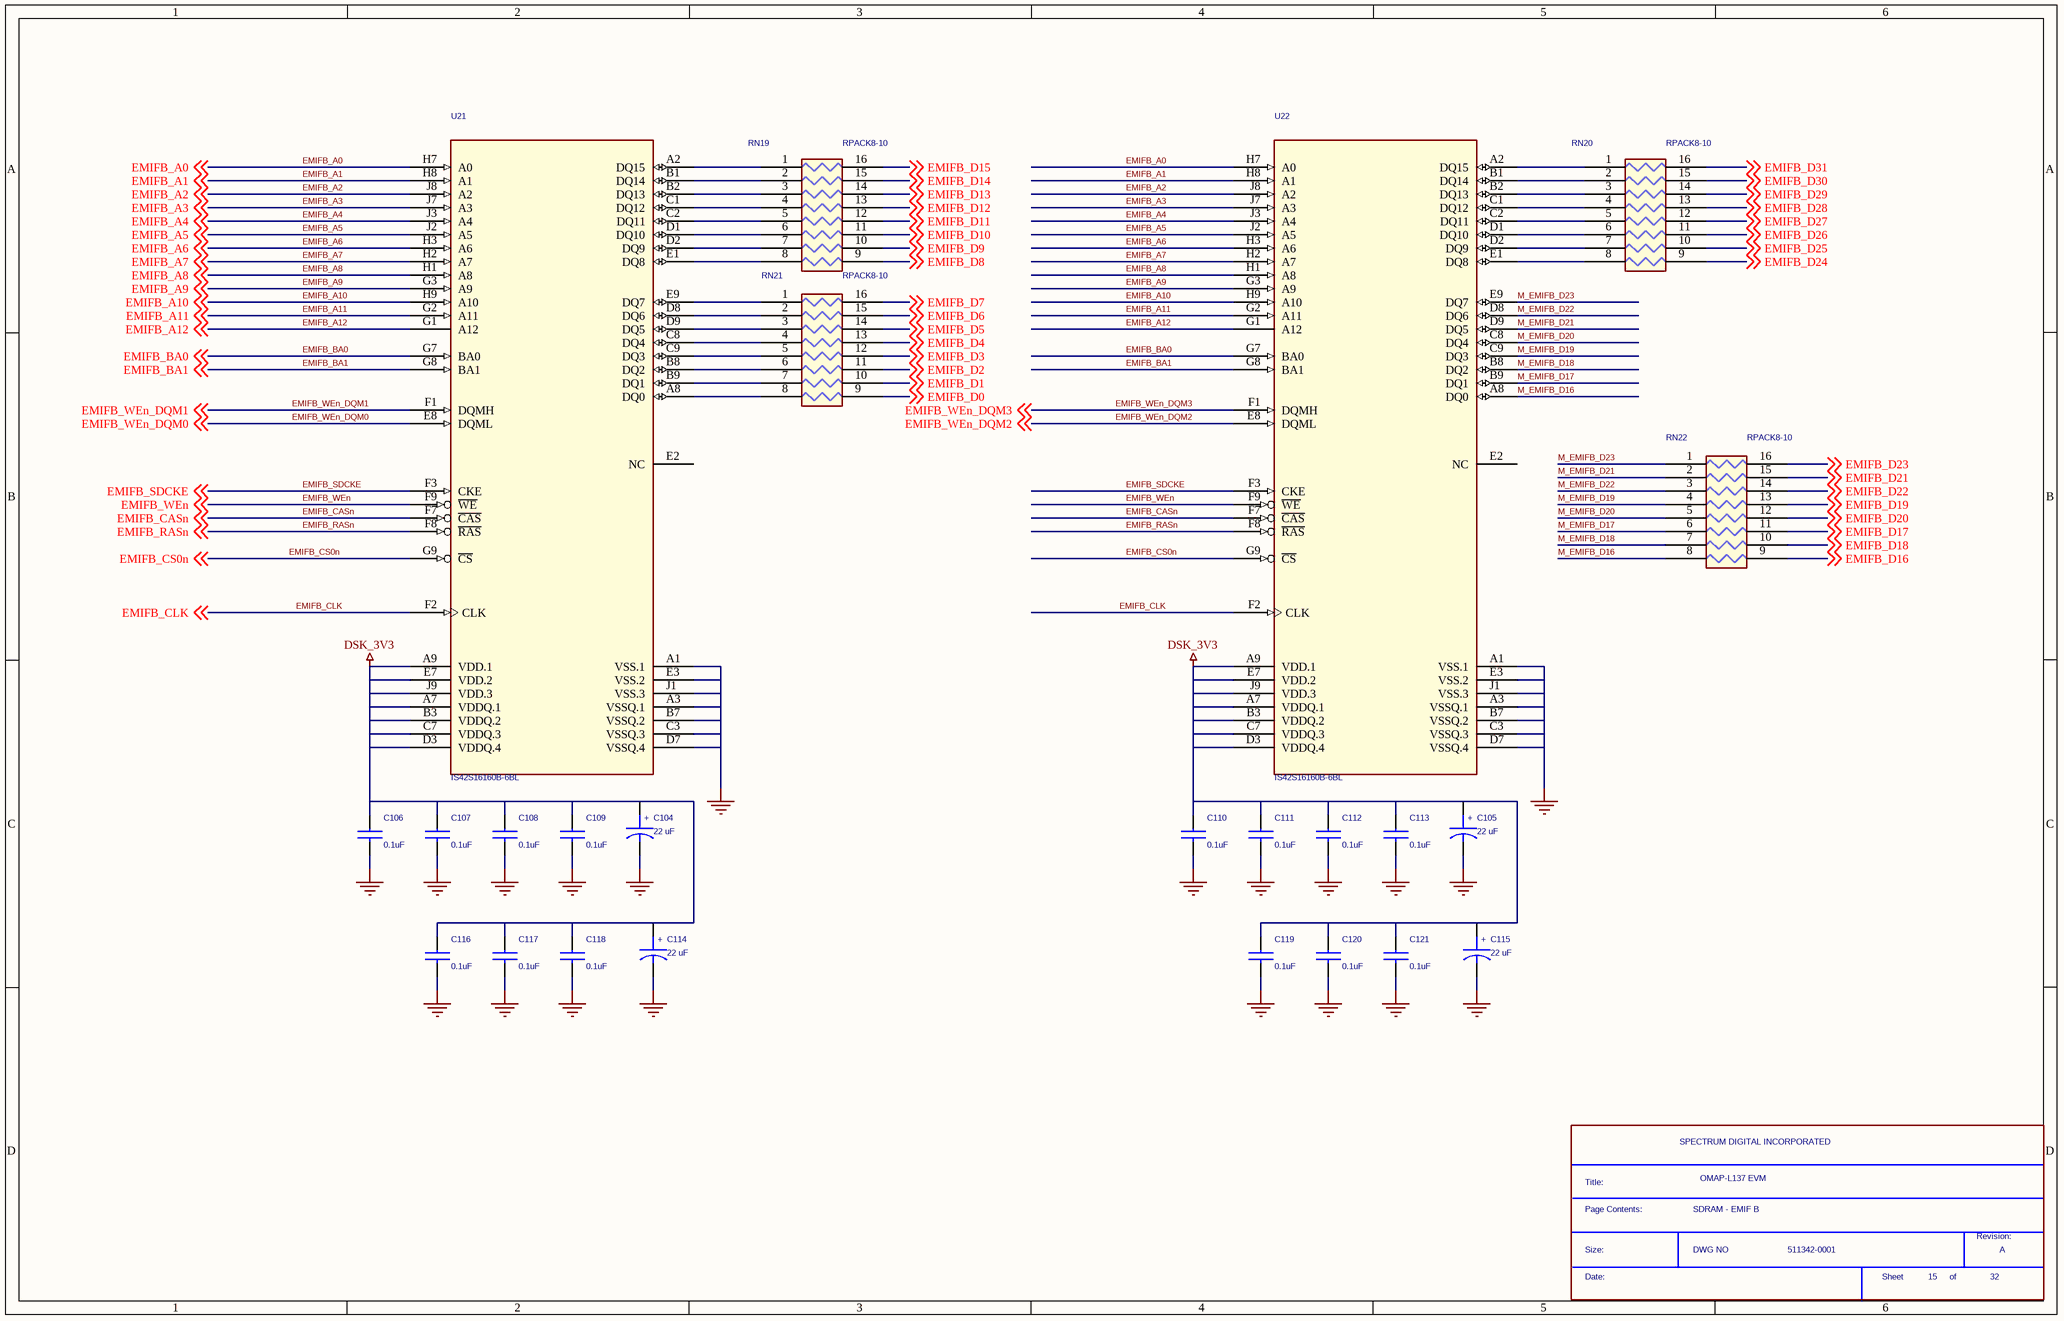
[diagram p17: SH15 - SDRAM EMIF B.SchDoc]

### Parts
(Parts that share a designator on the sheet are numbered #1, #2 ... from top to bottom, then left to right.)
*#18  Page Contents:: SDRAM - EMIF B  RevCode: A  Title: OMAP-L137 EVM  OrgName: SPECTRUM DIGITAL INCORPORATED  Doc: 511342-0001  Page Number: 15  Page Count: 32  (hidden comment: SDTitleBlock)  (graphical)
C104  22 uF  [C1206-40X70]
C105  22 uF  [C1206-40X70]
C106  0.1uF  [c402-25]
C107  0.1uF  [c402-25]
C108  0.1uF  [c402-25]
C109  0.1uF  [c402-25]
C110  0.1uF  [c402-25]
C111  0.1uF  [c402-25]
C112  0.1uF  [c402-25]
C113  0.1uF  [c402-25]
C114  22 uF  [C1206-40X70]
C115  22 uF  [C1206-40X70]
C116  0.1uF  [c402-25]
C117  0.1uF  [c402-25]
C118  0.1uF  [c402-25]
C119  0.1uF  [c402-25]
C120  0.1uF  [c402-25]
C121  0.1uF  [c402-25]
RN19  RPACK8-10  [rpak16-10x25-2hv]
RN20  RPACK8-10  [rpak16-10x25-2hv]
RN21  RPACK8-10  [rpak16-10x25-2hv]
RN22  RPACK8-10  [rpak16-10x25-2hv]
U21  IS42S16160B-6BL  [bga54-3x9-issi]
U22  IS42S16160B-6BL  [bga54-3x9-issi]

### Nets
DSK_3V3: C104.1(ANODE) C105.1(ANODE) C106.1 C107.1 C108.1 C109.1 C110.1 C111.1 C112.1 C113.1 C114.1(ANODE) C115.1(ANODE) C116.1 C117.1 C118.1 C119.1 C120.1 C121.1 U21.A7(VDDQ.1) U21.A9(VDD.1) U21.B3(VDDQ.2) U21.C7(VDDQ.3) U21.D3(VDDQ.4) U21.E7(VDD.2) U21.J9(VDD.3) U22.A7(VDDQ.1) U22.A9(VDD.1) U22.B3(VDDQ.2) U22.C7(VDDQ.3) U22.D3(VDDQ.4) U22.E7(VDD.2) U22.J9(VDD.3)
GND: C104.2(CATHODE) C105.2(CATHODE) C106.2 C107.2 C108.2 C109.2 C110.2 C111.2 C112.2 C113.2 C114.2(CATHODE) C115.2(CATHODE) C116.2 C117.2 C118.2 C119.2 C120.2 C121.2 U21.A1(VSS.1) U21.A3(VSSQ.1) U21.B7(VSSQ.2) U21.C3(VSSQ.3) U21.D7(VSSQ.4) U21.E3(VSS.2) U21.J1(VSS.3) U22.A1(VSS.1) U22.A3(VSSQ.1) U22.B7(VSSQ.2) U22.C3(VSSQ.3) U22.D7(VSSQ.4) U22.E3(VSS.2) U22.J1(VSS.3)
EMIFB_A0: U21.H7(A0) U22.H7(A0) ; off-sheet EMIFB_A0
EMIFB_A1: U21.H8(A1) U22.H8(A1) ; off-sheet EMIFB_A1
EMIFB_A2: U21.J8(A2) U22.J8(A2) ; off-sheet EMIFB_A2
EMIFB_A3: U21.J7(A3) U22.J7(A3) ; off-sheet EMIFB_A3
EMIFB_A4: U21.J3(A4) U22.J3(A4) ; off-sheet EMIFB_A4
EMIFB_A5: U21.J2(A5) U22.J2(A5) ; off-sheet EMIFB_A5
EMIFB_A6: U21.H3(A6) U22.H3(A6) ; off-sheet EMIFB_A6
EMIFB_A7: U21.H2(A7) U22.H2(A7) ; off-sheet EMIFB_A7
EMIFB_A8: U21.H1(A8) U22.H1(A8) ; off-sheet EMIFB_A8
EMIFB_A9: U21.G3(A9) U22.G3(A9) ; off-sheet EMIFB_A9
EMIFB_A10: U21.H9(A10) U22.H9(A10) ; off-sheet EMIFB_A10
EMIFB_A11: U21.G2(A11) U22.G2(A11) ; off-sheet EMIFB_A11
EMIFB_A12: U21.G1(A12) U22.G1(A12) ; off-sheet EMIFB_A12
EMIFB_BA0: U21.G7(BA0) U22.G7(BA0) ; off-sheet EMIFB_BA0
EMIFB_BA1: U21.G8(BA1) U22.G8(BA1) ; off-sheet EMIFB_BA1
EMIFB_CASn: U21.F7(~{CAS}) U22.F7(~{CAS}) ; off-sheet EMIFB_CASn
EMIFB_CLK: U21.F2(CLK) U22.F2(CLK) ; off-sheet EMIFB_CLK
EMIFB_CS0n: U21.G9(~{CS}) U22.G9(~{CS}) ; off-sheet EMIFB_CS0n
EMIFB_D0: RN21.9 ; off-sheet EMIFB_D0
EMIFB_D1: RN21.10 ; off-sheet EMIFB_D1
EMIFB_D2: RN21.11 ; off-sheet EMIFB_D2
EMIFB_D3: RN21.12 ; off-sheet EMIFB_D3
EMIFB_D4: RN21.13 ; off-sheet EMIFB_D4
EMIFB_D5: RN21.14 ; off-sheet EMIFB_D5
EMIFB_D6: RN21.15 ; off-sheet EMIFB_D6
EMIFB_D7: RN21.16 ; off-sheet EMIFB_D7
EMIFB_D8: RN19.9 ; off-sheet EMIFB_D8
EMIFB_D9: RN19.10 ; off-sheet EMIFB_D9
EMIFB_D10: RN19.11 ; off-sheet EMIFB_D10
EMIFB_D11: RN19.12 ; off-sheet EMIFB_D11
EMIFB_D12: RN19.13 ; off-sheet EMIFB_D12
EMIFB_D13: RN19.14 ; off-sheet EMIFB_D13
EMIFB_D14: RN19.15 ; off-sheet EMIFB_D14
EMIFB_D15: RN19.16 ; off-sheet EMIFB_D15
EMIFB_D16: RN22.9 ; off-sheet EMIFB_D16
EMIFB_D17: RN22.11 ; off-sheet EMIFB_D17
EMIFB_D18: RN22.10 ; off-sheet EMIFB_D18
EMIFB_D19: RN22.13 ; off-sheet EMIFB_D19
EMIFB_D20: RN22.12 ; off-sheet EMIFB_D20
EMIFB_D21: RN22.15 ; off-sheet EMIFB_D21
EMIFB_D22: RN22.14 ; off-sheet EMIFB_D22
EMIFB_D23: RN22.16 ; off-sheet EMIFB_D23
EMIFB_D24: RN20.9 ; off-sheet EMIFB_D24
EMIFB_D25: RN20.10 ; off-sheet EMIFB_D25
EMIFB_D26: RN20.11 ; off-sheet EMIFB_D26
EMIFB_D27: RN20.12 ; off-sheet EMIFB_D27
EMIFB_D28: RN20.13 ; off-sheet EMIFB_D28
EMIFB_D29: RN20.14 ; off-sheet EMIFB_D29
EMIFB_D30: RN20.15 ; off-sheet EMIFB_D30
EMIFB_D31: RN20.16 ; off-sheet EMIFB_D31
EMIFB_RASn: U21.F8(~{RAS}) U22.F8(~{RAS}) ; off-sheet EMIFB_RASn
EMIFB_SDCKE: U21.F3(CKE) U22.F3(CKE) ; off-sheet EMIFB_SDCKE
EMIFB_WEn: U21.F9(~{WE}) U22.F9(~{WE}) ; off-sheet EMIFB_WEn
EMIFB_WEn_DQM0: U21.E8(DQML) ; off-sheet EMIFB_WEn_DQM0
EMIFB_WEn_DQM1: U21.F1(DQMH) ; off-sheet EMIFB_WEn_DQM1
EMIFB_WEn_DQM2: U22.E8(DQML) ; off-sheet EMIFB_WEn_DQM2
EMIFB_WEn_DQM3: U22.F1(DQMH) ; off-sheet EMIFB_WEn_DQM3
M_EMIFB_D16: RN22.8 U22.A8(DQ0)
M_EMIFB_D17: RN22.6 U22.B9(DQ1)
M_EMIFB_D18: RN22.7 U22.B8(DQ2)
M_EMIFB_D19: RN22.4 U22.C9(DQ3)
M_EMIFB_D20: RN22.5 U22.C8(DQ4)
M_EMIFB_D21: RN22.2 U22.D9(DQ5)
M_EMIFB_D22: RN22.3 U22.D8(DQ6)
M_EMIFB_D23: RN22.1 U22.E9(DQ7)
NetRN19_1: RN19.1 U21.A2(DQ15)
NetRN19_2: RN19.2 U21.B1(DQ14)
NetRN19_3: RN19.3 U21.B2(DQ13)
NetRN19_4: RN19.4 U21.C1(DQ12)
NetRN19_5: RN19.5 U21.C2(DQ11)
NetRN19_6: RN19.6 U21.D1(DQ10)
NetRN19_7: RN19.7 U21.D2(DQ9)
NetRN19_8: RN19.8 U21.E1(DQ8)
NetRN20_1: RN20.1 U22.A2(DQ15)
NetRN20_2: RN20.2 U22.B1(DQ14)
NetRN20_3: RN20.3 U22.B2(DQ13)
NetRN20_4: RN20.4 U22.C1(DQ12)
NetRN20_5: RN20.5 U22.C2(DQ11)
NetRN20_6: RN20.6 U22.D1(DQ10)
NetRN20_7: RN20.7 U22.D2(DQ9)
NetRN20_8: RN20.8 U22.E1(DQ8)
NetRN21_1: RN21.1 U21.E9(DQ7)
NetRN21_2: RN21.2 U21.D8(DQ6)
NetRN21_3: RN21.3 U21.D9(DQ5)
NetRN21_4: RN21.4 U21.C8(DQ4)
NetRN21_5: RN21.5 U21.C9(DQ3)
NetRN21_6: RN21.6 U21.B8(DQ2)
NetRN21_7: RN21.7 U21.B9(DQ1)
NetRN21_8: RN21.8 U21.A8(DQ0)

Not connected (* = marked no-connect by the designer): U21 E2(NC); U22 E2(NC)

### Notes on the sheet
- (in symbol CAP P) +
- (in symbol SDTitleBlock) Title:; Page Contents:; Revision:; Size:; DWG NO; Date:; Sheet; of

### Library data of the parts
C104 C105 C114 = CAP P: Part #: 101064-0221R; Spectrum Part#: 101347-0102
C106-C113 C116-C121 = CAP NP_0: Part #: 101587-1100R
C115 = CAP P: Spectrum Part#: 101347-0102; Part #: 101064-0221R
RN19-RN22 = RESISTOR DIP 8_0: Part #: 101069-1000R
U21 U22 = IS42S16160B-6BL_0: Part #: 102799-0006R

## Sheet SH14 - BOOT MODE.SchDoc
size 386 x 246 mm
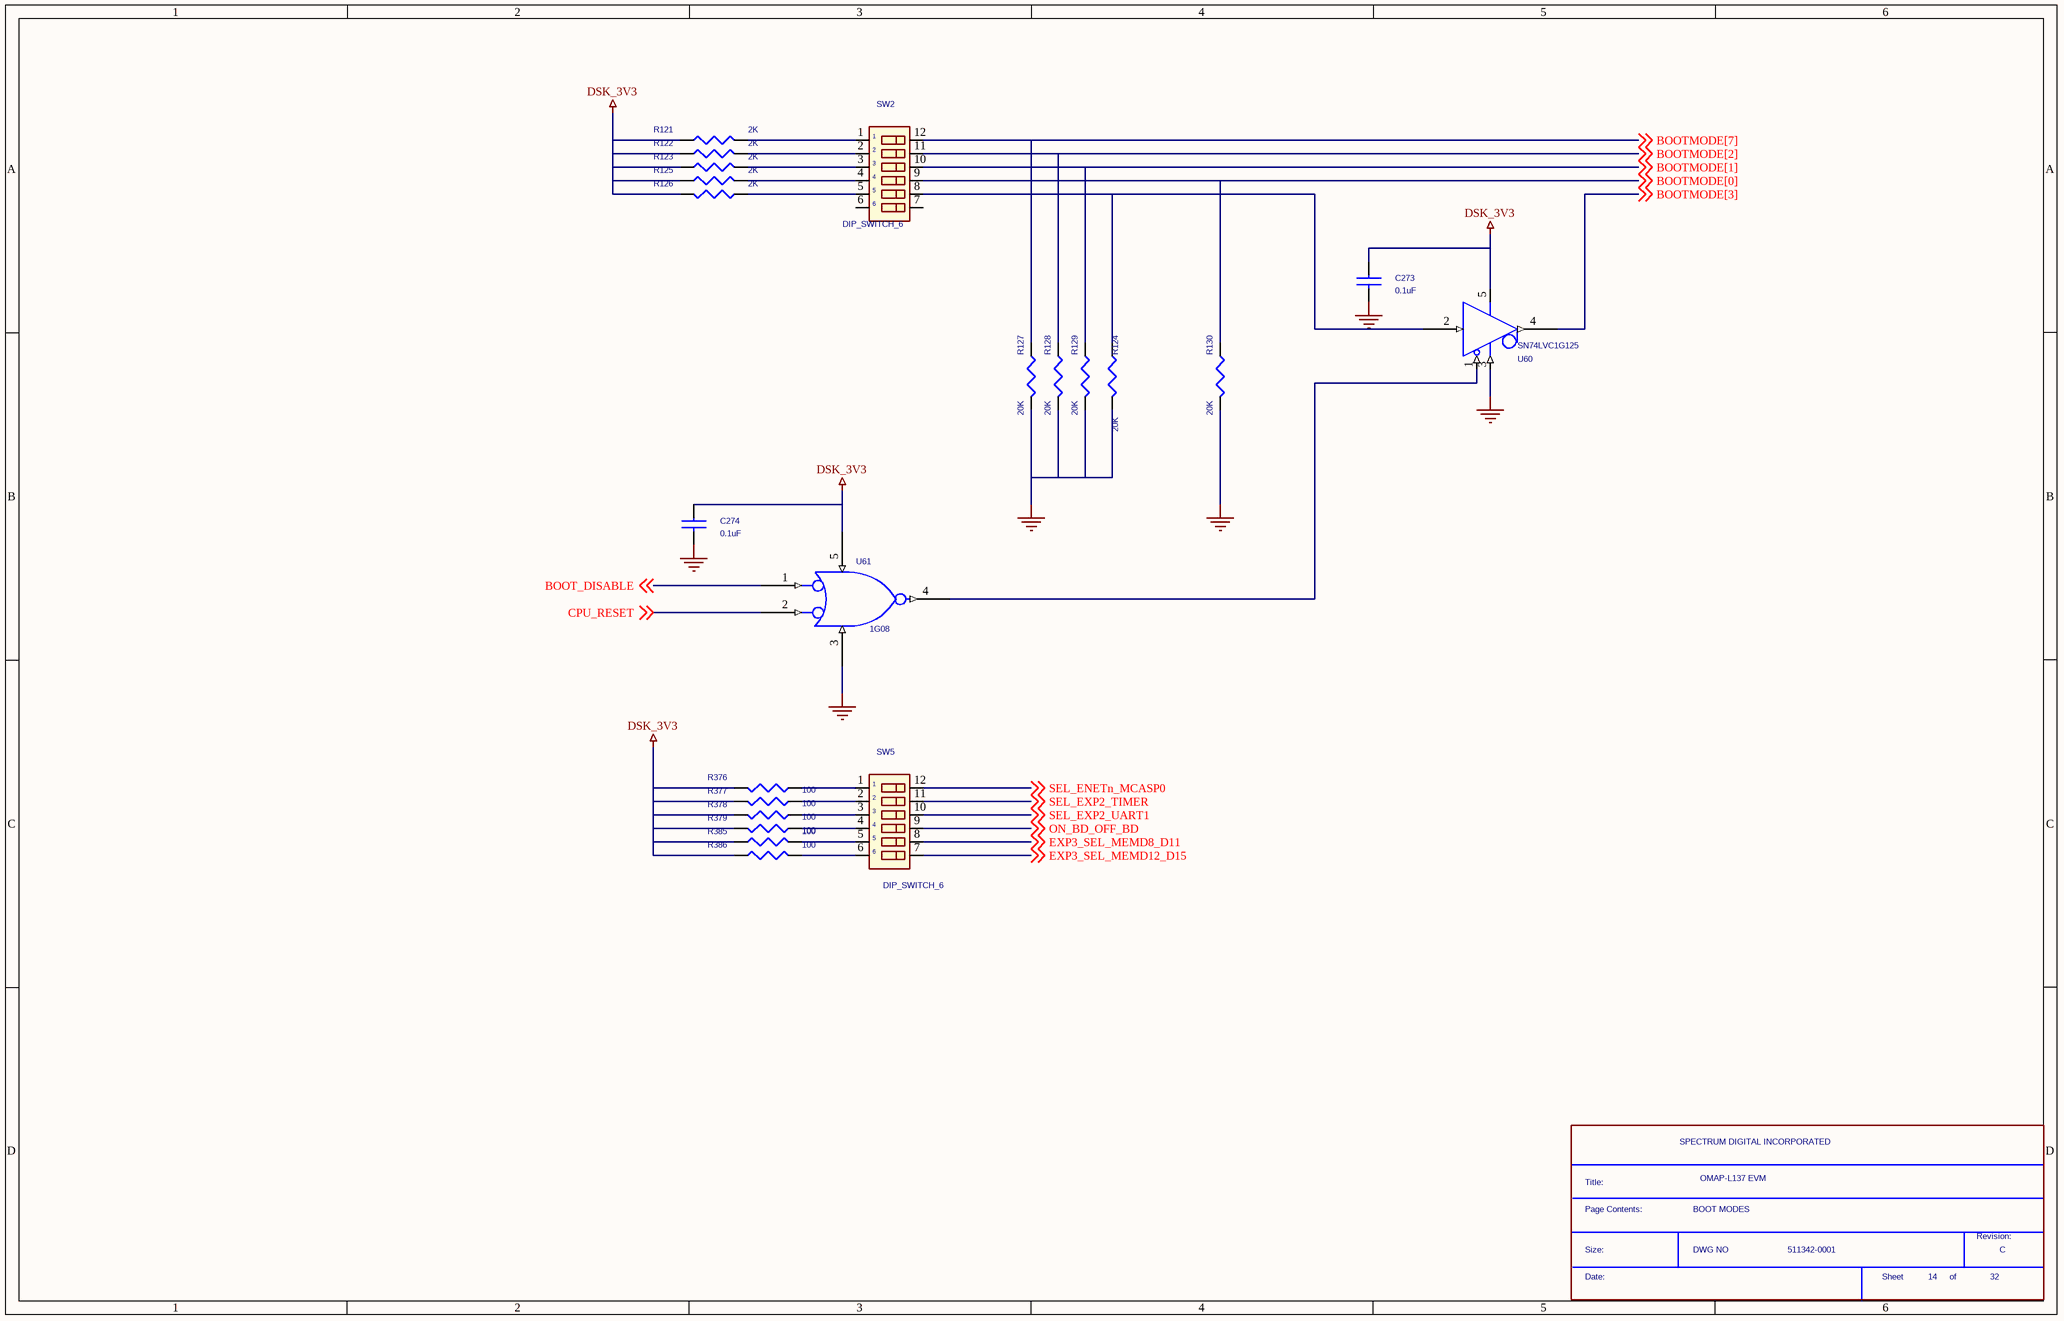
[diagram p18: SH14 - BOOT MODE.SchDoc]

### Parts
(Parts that share a designator on the sheet are numbered #1, #2 ... from top to bottom, then left to right.)
*#19  Page Contents:: BOOT MODES  RevCode: C  Title: OMAP-L137 EVM  OrgName: SPECTRUM DIGITAL INCORPORATED  Doc: 511342-0001  Page Number: 14  Page Count: 32  (hidden comment: SDTitleBlock)  (graphical)
C273  0.1uF  [c402-25]
C274  0.1uF  [c402-25]
R121  2K  [r402-25]
R122  2K  [r402-25]
R123  2K  [r402-25]
R124  20K  [r402-25]
R125  2K  [r402-25]
R126  2K  [r402-25]
R127  20K  [r402-25]
R128  20K  [r402-25]
R129  20K  [r402-25]
R130  20K  [r402-25]
R376  100  [r402-25]
R377  100  [r402-25]
R378  100  [r402-25]
R379  100  [r402-25]
R385  100  [r402-25]
R386  100  [r402-25]
SW2  DIP_SWITCH_6  [DIP_SWITCH_10]
SW5  DIP_SWITCH_6  [DIP_SWITCH_10]
U60  SN74LVC1G125  [DCK]
U61  1G08  [SO5]

### Nets
DSK_3V3: C273.1 C274.1 R121.1 R122.1 R123.1 R125.1 R126.2 R376.1 R377.1 R378.1 R379.1 R385.1 R386.1 U60.5(VCC) U61.5(VCC)
GND: C273.2 C274.2 R124.1 R127.2 R128.2 R129.2 R130.2 U60.3(GND) U61.3(GND)
BOOT_DISABLE: U61.1(B) ; off-sheet BOOT_DISABLE
BOOTMODE[0]: R130.1 SW2.9 ; off-sheet BOOTMODE[0]
BOOTMODE[1]: R129.1 SW2.10 ; off-sheet BOOTMODE[1]
BOOTMODE[2]: R128.1 SW2.11 ; off-sheet BOOTMODE[2]
BOOTMODE[3]: U60.4(O) ; off-sheet BOOTMODE[3]
BOOTMODE[7]: R127.1 SW2.12 ; off-sheet BOOTMODE[7]
CPU_RESET: U61.2(A) ; off-sheet CPU_RESET
EXP3_SEL_MEMD8_D11: SW5.8 ; off-sheet EXP3_SEL_MEMD8_D11
EXP3_SEL_MEMD12_D15: SW5.7 ; off-sheet EXP3_SEL_MEMD12_D15
ON_BD_OFF_BD: SW5.9 ; off-sheet ON_BD_OFF_BD
SEL_ENETn_MCASP0: SW5.12 ; off-sheet SEL_ENETn_MCASP0
SEL_EXP2_TIMER: SW5.11 ; off-sheet SEL_EXP2_TIMER
SEL_EXP2_UART1: SW5.10 ; off-sheet SEL_EXP2_UART1
NetR121_2: R121.2 SW2.1
NetR122_2: R122.2 SW2.2
NetR123_2: R123.2 SW2.3
NetR124_2: R124.2 SW2.8 U60.2(I)
NetR125_2: R125.2 SW2.4
NetR126_1: R126.1 SW2.5
NetR376_2: R376.2 SW5.1
NetR377_2: R377.2 SW5.2
NetR378_2: R378.2 SW5.3
NetR379_2: R379.2 SW5.4
NetR385_2: R385.2 SW5.5
NetR386_2: R386.2 SW5.6
NetU60_1: U60.1(OE) U61.4(Y)

Not connected (* = marked no-connect by the designer): SW2 6 7

### Notes on the sheet
- (in symbol SDTitleBlock) Title:; Page Contents:; Revision:; Size:; DWG NO; Date:; Sheet; of

### Library data of the parts
C273 = CAP NP
C274 = CAP NP_0
R121-R123 R125 R126 = R_1: Part #: 101370-2002R
R124 R127-R130 = R_1: Part #: 101370-2003R
R376-R379 R385 R386 = R: Part #: 101370-1001R
SW2 SW5 = DIP_SWITCH_0: Part #: 101184-0006R

## Sheet SH13 - OMAP-L137 CAPS.SchDoc
size 386 x 246 mm
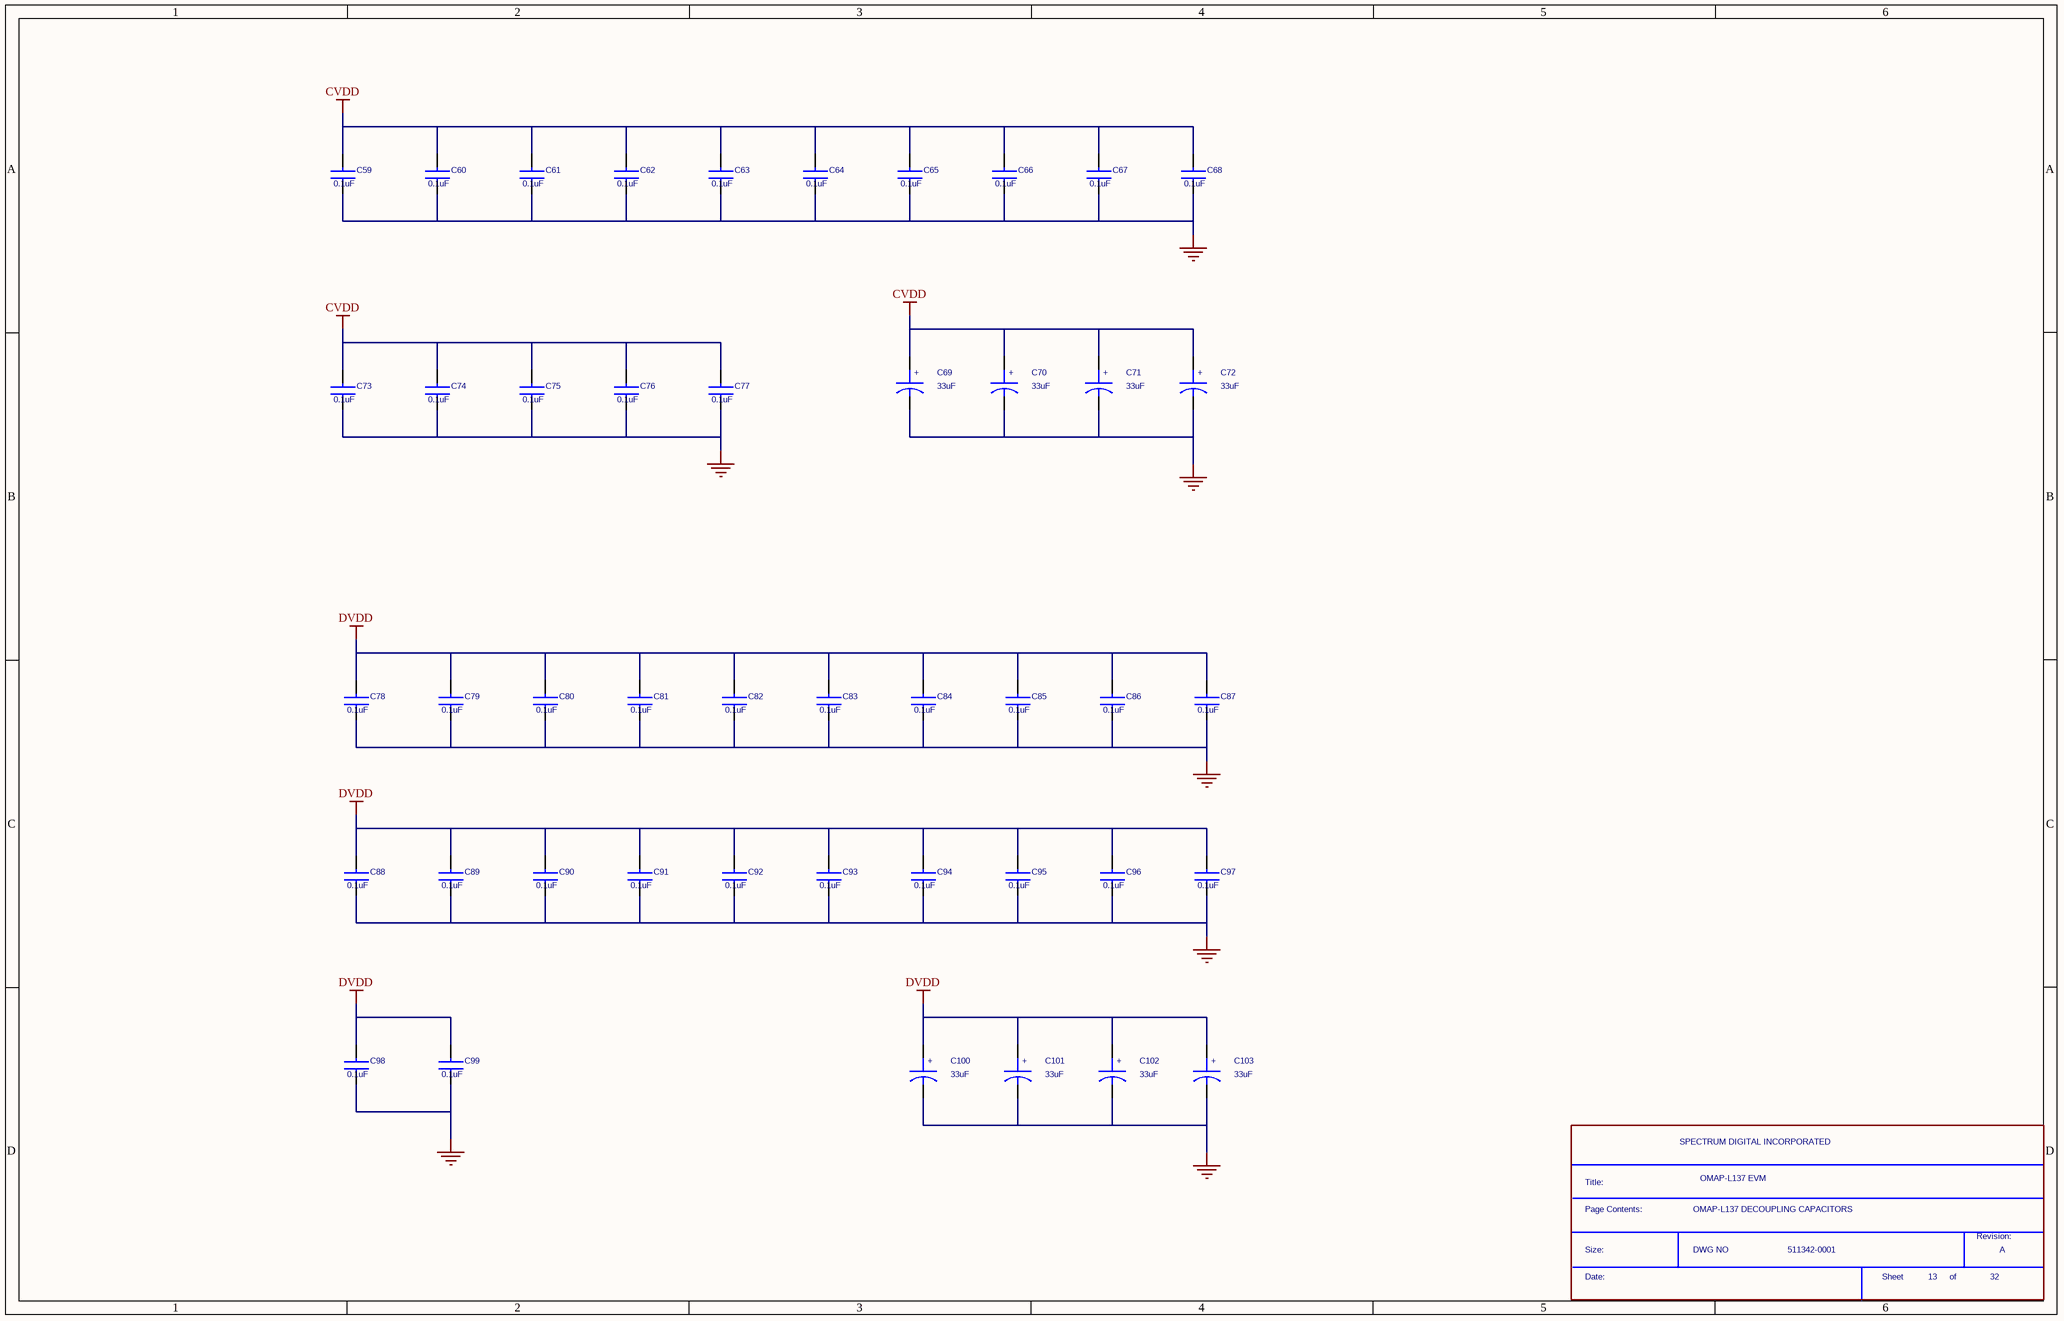
[diagram p19: SH13 - OMAP-L137 CAPS.SchDoc]

### Parts
(Parts that share a designator on the sheet are numbered #1, #2 ... from top to bottom, then left to right.)
*#20  Page Contents:: OMAP-L137 DECOUPLING CAPACITORS  RevCode: A  Title: OMAP-L137 EVM  OrgName: SPECTRUM DIGITAL INCORPORATED  Doc: 511342-0001  Page Number: 13  Page Count: 32  (hidden comment: SDTitleBlock)  (graphical)
C59  0.1uF  [1206]
C60  0.1uF  [1206]
C61  0.1uF  [1206]
C62  0.1uF  [1206]
C63  0.1uF  [1206]
C64  0.1uF  [1206]
C65  0.1uF  [1206]
C66  0.1uF  [1206]
C67  0.1uF  [1206]
C68  0.1uF  [1206]
C69  33uF  [c1206-40x70p]
C70  33uF  [c1206-40x70p]
C71  33uF  [c1206-40x70p]
C72  33uF  [c1206-40x70p]
C73  0.1uF  [1206]
C74  0.1uF  [1206]
C75  0.1uF  [1206]
C76  0.1uF  [1206]
C77  0.1uF  [1206]
C78  0.1uF  [1206]
C79  0.1uF  [1206]
C80  0.1uF  [1206]
C81  0.1uF  [1206]
C82  0.1uF  [1206]
C83  0.1uF  [1206]
C84  0.1uF  [1206]
C85  0.1uF  [1206]
C86  0.1uF  [1206]
C87  0.1uF  [1206]
C88  0.1uF  [1206]
C89  0.1uF  [1206]
C90  0.1uF  [1206]
C91  0.1uF  [1206]
C92  0.1uF  [1206]
C93  0.1uF  [1206]
C94  0.1uF  [1206]
C95  0.1uF  [1206]
C96  0.1uF  [1206]
C97  0.1uF  [1206]
C98  0.1uF  [1206]
C99  0.1uF  [1206]
C100  33uF  [c1206-40x70p]
C101  33uF  [c1206-40x70p]
C102  33uF  [c1206-40x70p]
C103  33uF  [c1206-40x70p]

### Nets
CVDD: C59.2 C60.2 C61.2 C62.2 C63.2 C64.2 C65.2 C66.2 C67.2 C68.2 C69.1(ANODE) C70.1(ANODE) C71.1(ANODE) C72.1(ANODE) C73.2 C74.2 C75.2 C76.2 C77.2
DVDD: C78.2 C79.2 C80.2 C81.2 C82.2 C83.2 C84.2 C85.2 C86.2 C87.2 C88.2 C89.2 C90.2 C91.2 C92.2 C93.2 C94.2 C95.2 C96.2 C97.2 C98.2 C99.2 C100.1(ANODE) C101.1(ANODE) C102.1(ANODE) C103.1(ANODE)
GND: C59.1 C60.1 C61.1 C62.1 C63.1 C64.1 C65.1 C66.1 C67.1 C68.1 C69.2(CATHODE) C70.2(CATHODE) C71.2(CATHODE) C72.2(CATHODE) C73.1 C74.1 C75.1 C76.1 C77.1 C78.1 C79.1 C80.1 C81.1 C82.1 C83.1 C84.1 C85.1 C86.1 C87.1 C88.1 C89.1 C90.1 C91.1 C92.1 C93.1 C94.1 C95.1 C96.1 C97.1 C98.1 C99.1 C100.2(CATHODE) C101.2(CATHODE) C102.2(CATHODE) C103.2(CATHODE)

### Notes on the sheet
- (in symbol CAP P) +
- (in symbol SDTitleBlock) Title:; Page Contents:; Revision:; Size:; DWG NO; Date:; Sheet; of

### Library data of the parts
C59-C68 C73-C99 = NPCap_0: Part #: 101587-1100R; SD PCB Footprint: EIA0603
C69-C72 C100-C102 = CAP P: Part #: 101953-0331R; Spectrum Part#: 101347-0102
C103 = CAP P: Spectrum Part#: 101347-0102; Part #: 101953-0331R

## Sheet SH12 - OMAP-L137 GND.SchDoc
size 386 x 246 mm
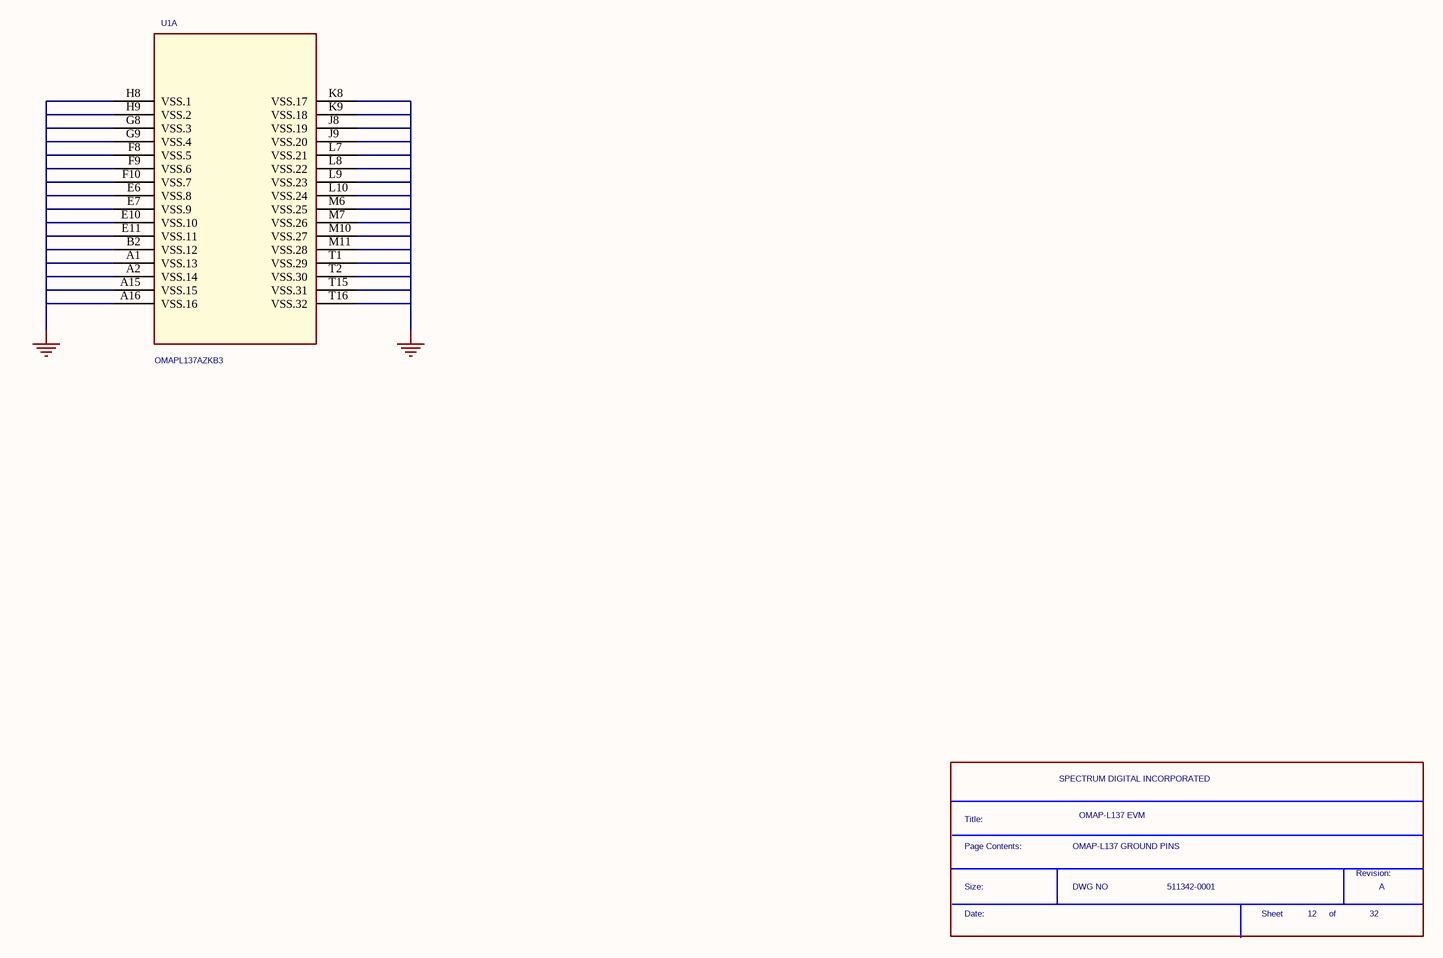
[diagram p20: SH12 - OMAP-L137 GND.SchDoc]

### Parts
(Parts that share a designator on the sheet are numbered #1, #2 ... from top to bottom, then left to right.)
*#21  Page Contents:: OMAP-L137 GROUND PINS  RevCode: A  Title: OMAP-L137 EVM  OrgName: SPECTRUM DIGITAL INCORPORATED  Doc: 511342-0001  Page Number: 12  Page Count: 32  (hidden comment: SDTitleBlock)  (graphical)
U1  OMAPL137AZKB3  [skt256-6064]  (part A of 9)

### Nets
GND: U1.A1(VSS.13) U1.A2(VSS.14) U1.A15(VSS.15) U1.A16(VSS.16) U1.B2(VSS.12) U1.E6(VSS.8) U1.E7(VSS.9) U1.E10(VSS.10) U1.E11(VSS.11) U1.F8(VSS.5) U1.F9(VSS.6) U1.F10(VSS.7) U1.G8(VSS.3) U1.G9(VSS.4) U1.H8(VSS.1) U1.H9(VSS.2) U1.J8(VSS.19) U1.J9(VSS.20) U1.K8(VSS.17) U1.K9(VSS.18) U1.L7(VSS.21) U1.L8(VSS.22) U1.L9(VSS.23) U1.L10(VSS.24) U1.M6(VSS.25) U1.M7(VSS.26) U1.M10(VSS.27) U1.M11(VSS.28) U1.T1(VSS.29) U1.T2(VSS.30) U1.T15(VSS.31) U1.T16(VSS.32)

### Notes on the sheet
- (in symbol SDTitleBlock) Title:; Page Contents:; Revision:; Size:; DWG NO; Date:; Sheet; of

### Library data of the parts
U1 = PRIMUS_BGA_1: Part #: 102772-0001; SWAP_INFO: (S1+S2+S3+S4+S5+S6+S7+S8+S9); SPLIT_INST: TRUE

## Sheet SH11 - OMAP-L137 POWER.SchDoc
size 386 x 246 mm
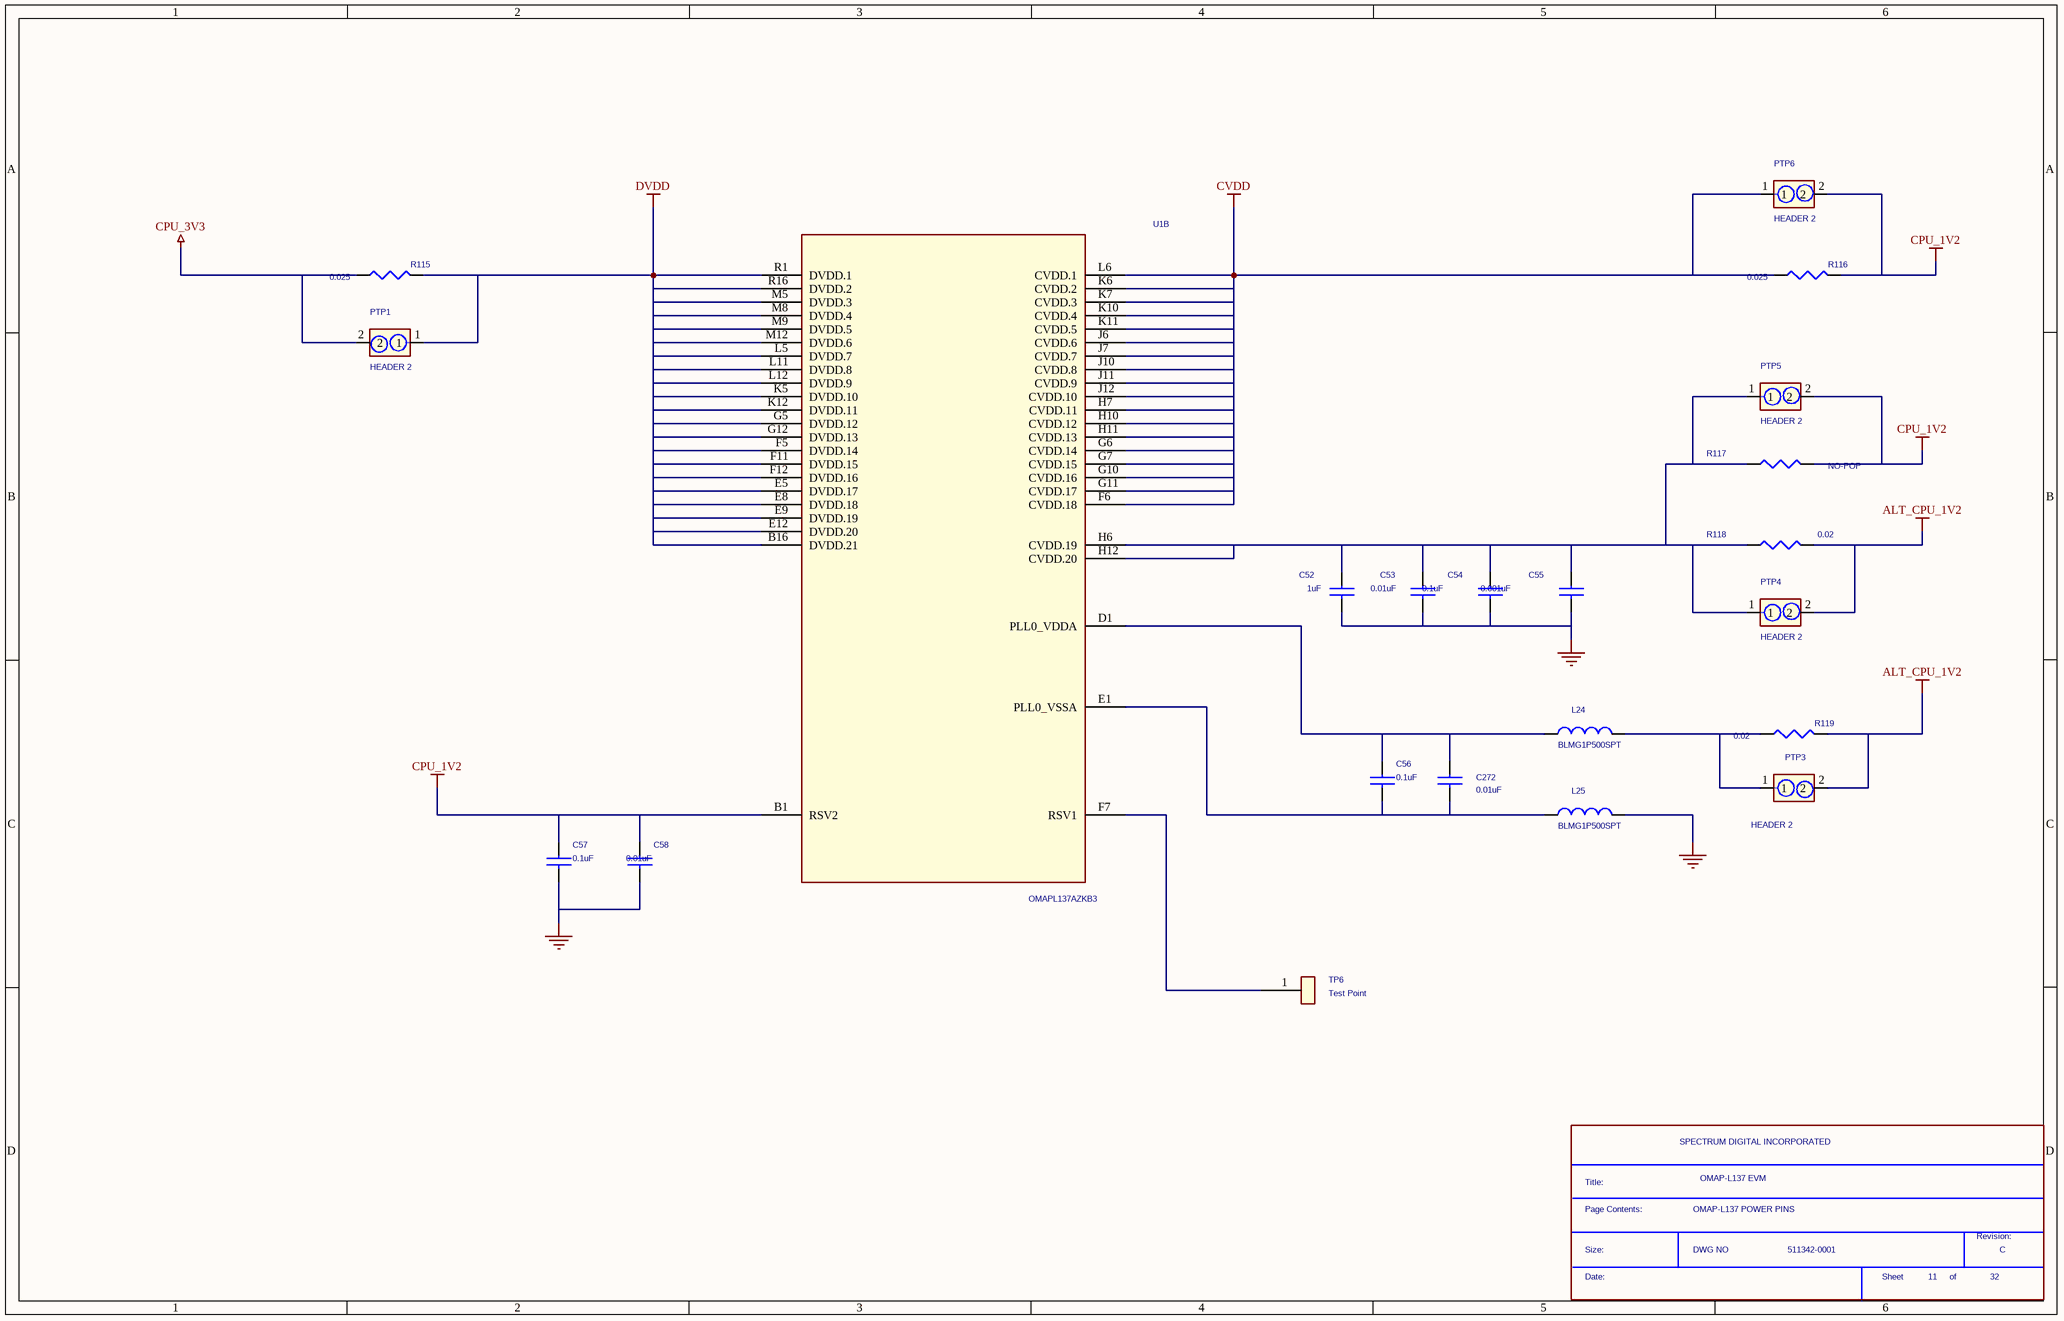
[diagram p21: SH11 - OMAP-L137 POWER.SchDoc]

### Parts
(Parts that share a designator on the sheet are numbered #1, #2 ... from top to bottom, then left to right.)
*#22  Page Contents:: OMAP-L137 POWER PINS  RevCode: C  Title: OMAP-L137 EVM  OrgName: SPECTRUM DIGITAL INCORPORATED  Doc: 511342-0001  Page Number: 11  Page Count: 32  (hidden comment: SDTitleBlock)  (graphical)
C52  1uF  [c603-35x45]
C53  0.01uF  [c402-25]
C54  0.1uF  [c402-25]
C55  0.001uF  [c402-25]
C56  0.1uF  [c402-25]
C57  0.1uF  [c402-25]
C58  0.01uF  [c402-25]
C272  0.01uF  [c402-25]
L24  BLMG1P500SPT  [emi-blm31p-40x70]
L25  BLMG1P500SPT  [emi-blm31p-40x70]
PTP1  HEADER 2  [JUMP1X2-6040]
PTP3  HEADER 2  [JUMP1X2-6040]
PTP4  HEADER 2  [JUMP1X2-6040]
PTP5  HEADER 2  [JUMP1X2-6040]
PTP6  HEADER 2  [JUMP1X2-6040]
R115  0.025  [r2512]
R116  0.025  [r2512]
R117  NO-POP  [r402-25]
R118  0.02  [r1206-40x70]
R119  0.02  [r1206-40x70]
TP6  Test Point  [tp1-6040]
U1  OMAPL137AZKB3  [skt256-6064]  (part B of 9)

### Nets
ALT_CPU_1V2: PTP3.2 PTP4.2 R118.2 R119.1
CPU_1V2: C57.1 C58.1 PTP5.2 PTP6.2 R116.1 R117.1 U1.B1(RSV2)
CPU_3V3: PTP1.2 R115.2
CVDD: PTP6.1 R116.2 U1.F6(CVDD.18) U1.G6(CVDD.14) U1.G7(CVDD.15) U1.G10(CVDD.16) U1.G11(CVDD.17) U1.H7(CVDD.11) U1.H10(CVDD.12) U1.H11(CVDD.13) U1.J6(CVDD.6) U1.J7(CVDD.7) U1.J10(CVDD.8) U1.J11(CVDD.9) U1.J12(CVDD.10) U1.K6(CVDD.2) U1.K7(CVDD.3) U1.K10(CVDD.4) U1.K11(CVDD.5) U1.L6(CVDD.1)
DVDD: PTP1.1 R115.1 U1.B16(DVDD.21) U1.E5(DVDD.17) U1.E8(DVDD.18) U1.E9(DVDD.19) U1.E12(DVDD.20) U1.F5(DVDD.14) U1.F11(DVDD.15) U1.F12(DVDD.16) U1.G5(DVDD.12) U1.G12(DVDD.13) U1.K5(DVDD.10) U1.K12(DVDD.11) U1.L5(DVDD.7) U1.L11(DVDD.8) U1.L12(DVDD.9) U1.M5(DVDD.3) U1.M8(DVDD.4) U1.M9(DVDD.5) U1.M12(DVDD.6) U1.R1(DVDD.1) U1.R16(DVDD.2)
GND: C52.2 C53.2 C54.2 C55.2 C57.2 C58.2 L25.2
NetC52_1: C52.1 C53.1 C54.1 C55.1 PTP4.1 PTP5.1 R117.2 R118.1 U1.H6(CVDD.19) U1.H12(CVDD.20)
NetC56_1: C56.1 C272.1 L24.1 U1.D1(PLL0_VDDA)
NetC56_2: C56.2 C272.2 L25.1 U1.E1(PLL0_VSSA)
NetL24_2: L24.2 PTP3.1 R119.2
NetTP6_1: TP6.1 U1.F7(RSV1)

### Notes on the sheet
- (in symbol SDTitleBlock) Title:; Page Contents:; Revision:; Size:; DWG NO; Date:; Sheet; of

### Library data of the parts
C52 = CAP NP: Part #: 101007-0100R
C53 C58 C272 = CAP NP: Part #: 101587-1101R
C54 C56 C57 = CAP NP: Part #: 101587-1100R
C55 = CAP NP: Part #: 102058-1102R
L24 L25 = INDUCTOR_0: Part Number: 134; Part #: 102870-5001R
PTP1 PTP3-PTP6 = PTP2: Single Line Header 2pin Tin; NCPartnumber: 2H0000; MfrNum: PTC02SAAN; Mfr: Sullins; Cost10K: 0.252; Vendor: Digikey; Cost100: 0.252; PartName: HEADER2Pin
R115 R116 = R: Part #: 100830-0025R
R117 = R: Part #: R0402-NOPOP
R118 R119 = R: Part #: 102598-0002R
TP6 = TEST POINT: Part #: 100115-0001R
U1 = PRIMUS_BGA_1: as U1 on sheet SH12 - OMAP-L137 GND

## Sheet SH10 - OMAP-L137 JTAG.SchDoc
size 386 x 246 mm
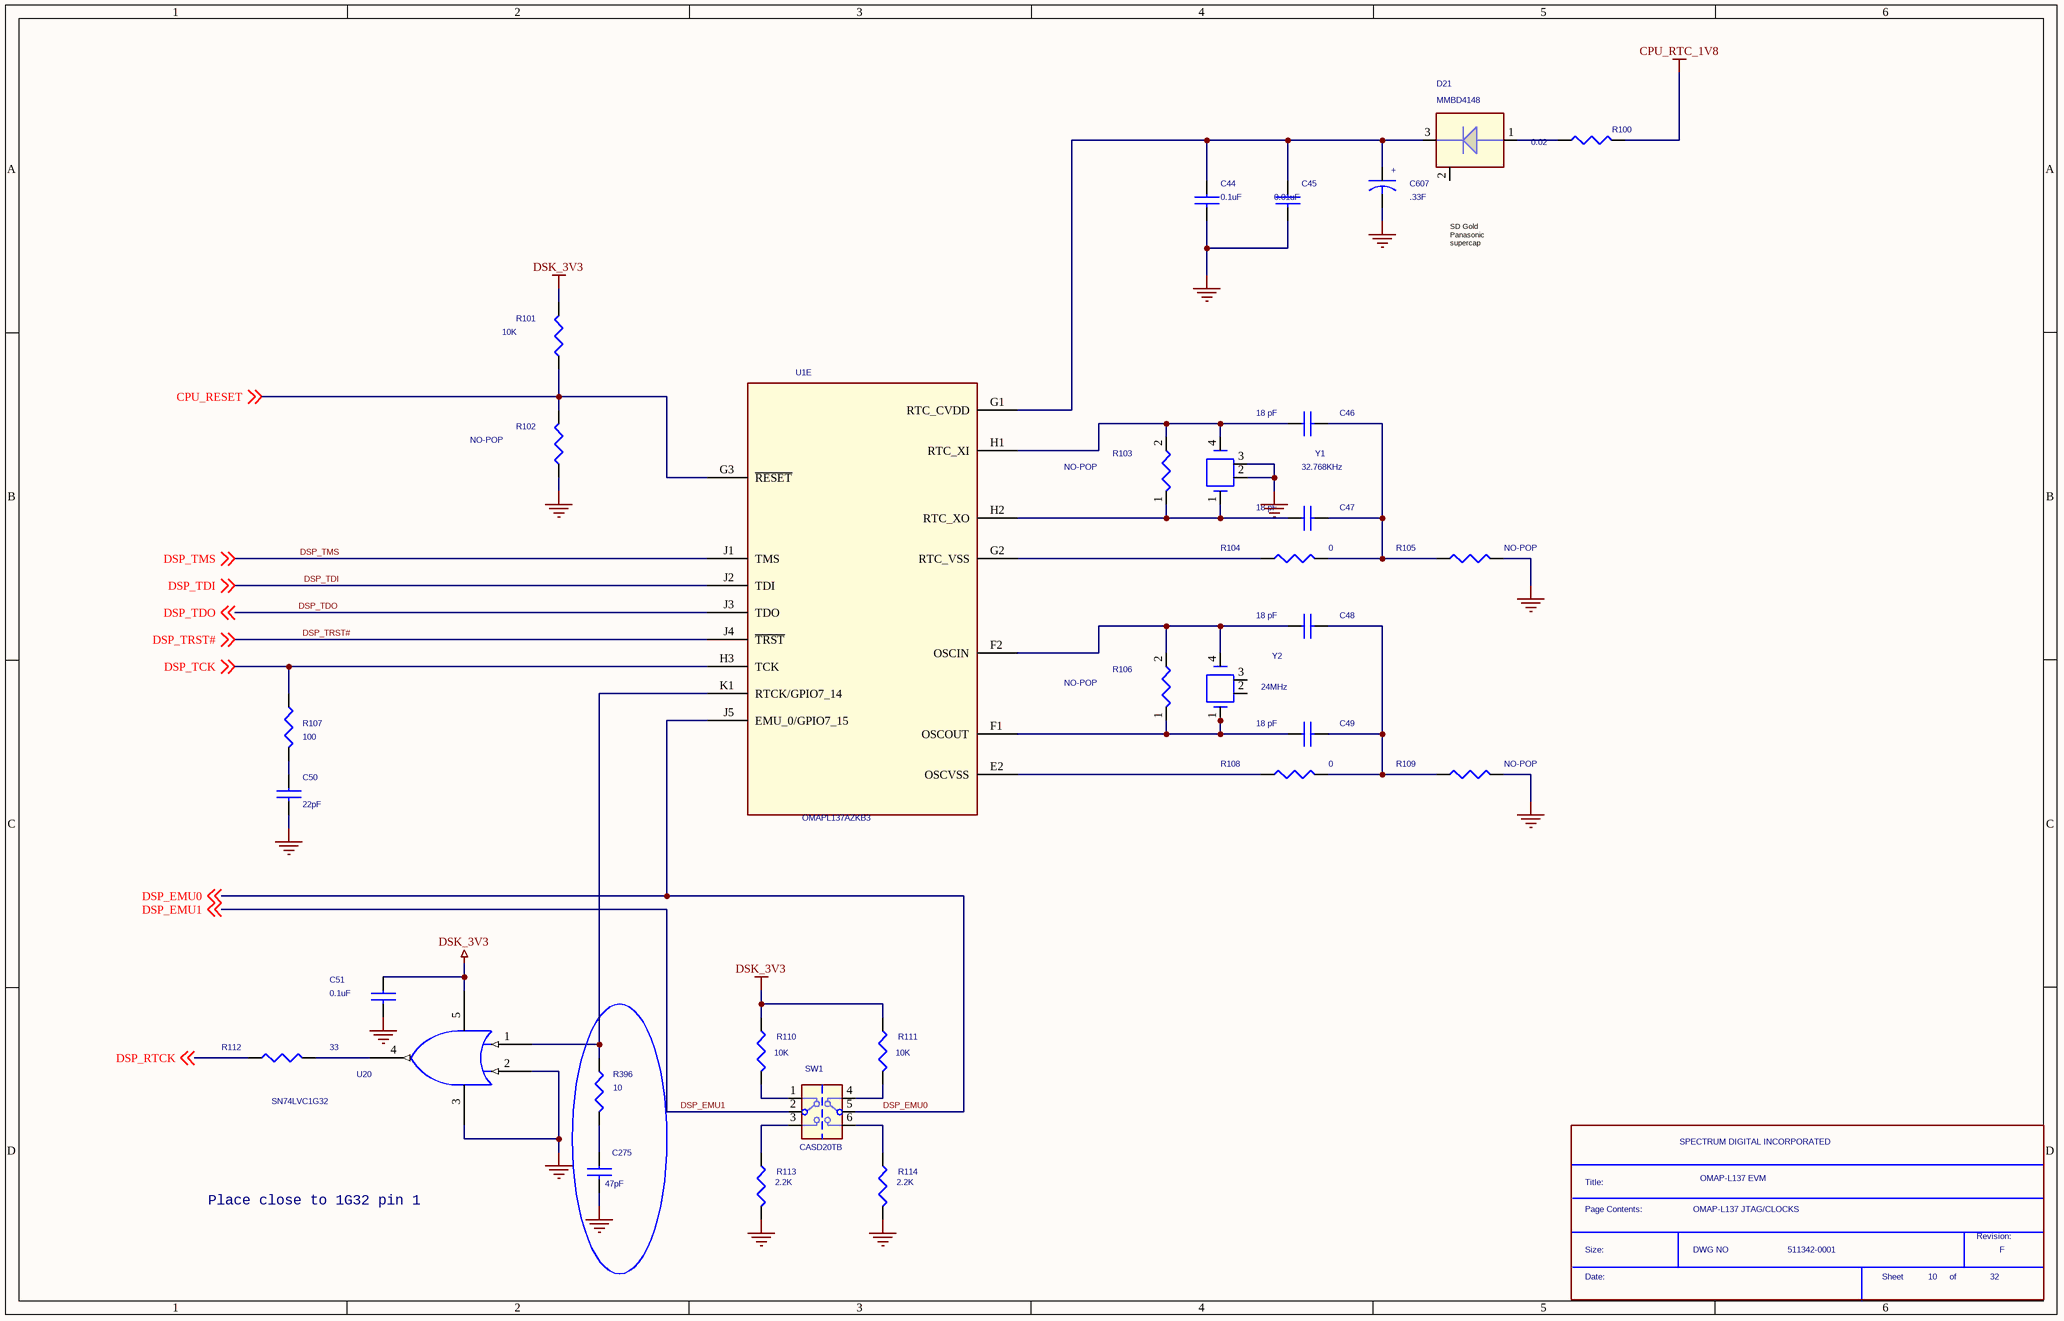
[diagram p22: SH10 - OMAP-L137 JTAG.SchDoc]

### Parts
(Parts that share a designator on the sheet are numbered #1, #2 ... from top to bottom, then left to right.)
*#23  Page Contents:: OMAP-L137 JTAG/CLOCKS  RevCode: F  Title: OMAP-L137 EVM  OrgName: SPECTRUM DIGITAL INCORPORATED  Doc: 511342-0001  Page Number: 10  Page Count: 32  (hidden comment: SDTitleBlock)  (graphical)
C44  0.1uF  [c402-25]
C45  0.01uF  [c402-25]
C46  18 pF  [c603-35x45]
C47  18 pF  [c603-35x45]
C48  18 pF  [c603-35x45]
C49  18 pF  [c603-35x45]
C50  22pF  [c603-35x45]
C51  0.1uF  [c402-25]
C275  47pF  [C0603]
C607  .33F  [EIA_D]
D21  MMBD4148  [SOT23-3]
R100  0.02  [r1206-40x70]
R101  10K  [r402-25]
R102  NO-POP  [r402-25]
R103  NO-POP  [r402-25]
R104  0  [r402-25]
R105  NO-POP  [r402-25]
R106  NO-POP  [r402-25]
R107  100  [r603-35x45]
R108  0  [r402-25]
R109  NO-POP  [r402-25]
R110  10K  [r402-25]
R111  10K  [r402-25]
R112  33  [r402-25]
R113  2.2K  [r402-25]
R114  2.2K  [r402-25]
R396  10  [r402-25]
SW1  CASD20TB  [sw6-40x67_gw]
U1  OMAPL137AZKB3  [skt256-6064]  (part E of 9)
U20  SN74LVC1G32  [SO5]
Y1  32.768KHz  [xtal4-23x47-ssp-t7]
Y2  24MHz  [xtal2-75x94]

### Nets
CPU_RTC_1V8: R100.1
DSK_3V3: C51.1 R101.1 R110.1 R111.1 U20.5(VCC)
GND: C44.2 C45.2 C50.2 C51.2 C275.2 C607.2 R102.2 R105.2 R109.2 R113.2 R114.2 U20.2(A) U20.3(GND) Y1.2 Y1.3
CPU_RESET: R101.2 R102.1 U1.G3(~{RESET}) ; off-sheet CPU_RESET
DSP_EMU0: SW1.5 U1.J5(EMU_0/GPIO7_15) ; off-sheet DSP_EMU0
DSP_EMU1: SW1.2 ; off-sheet DSP_EMU1
DSP_RTCK: R112.1 ; off-sheet DSP_RTCK
DSP_TCK: R107.1 U1.H3(TCK) ; off-sheet DSP_TCK
DSP_TDI: U1.J2(TDI) ; off-sheet DSP_TDI
DSP_TDO: U1.J3(TDO) ; off-sheet DSP_TDO
DSP_TMS: U1.J1(TMS) ; off-sheet DSP_TMS
DSP_TRST#: U1.J4(~{TRST}) ; off-sheet DSP_TRST#
NetC44_1: C44.1 C45.1 C607.1 D21.3(CATHODE) U1.G1(RTC_CVDD)
NetC46_1: C46.1 R103.2 U1.H1(RTC_XI) Y1.4
NetC46_2: C46.2 C47.2 R104.2 R105.1
NetC47_1: C47.1 R103.1 U1.H2(RTC_XO) Y1.1
NetC48_1: C48.1 R106.2 U1.F2(OSCIN) Y2.4
NetC48_2: C48.2 C49.2 R108.2 R109.1
NetC49_1: C49.1 R106.1 U1.F1(OSCOUT) Y2.1
NetC50_1: C50.1 R107.2
NetC275_1: C275.1 R396.2
NetD21_1: D21.1(ANODE) R100.2
NetR104_1: R104.1 U1.G2(RTC_VSS)
NetR108_1: R108.1 U1.E2(OSCVSS)
NetR110_2: R110.2 SW1.1
NetR111_2: R111.2 SW1.4
NetR112_2: R112.2 U20.4(Y)
NetR113_1: R113.1 SW1.3
NetR114_1: R114.1 SW1.6
NetR396_1: R396.1 U1.K1(RTCK/GPIO7_14) U20.1(B)

Not connected (* = marked no-connect by the designer): D21 2; Y2 2 3

### Notes on the sheet
- SD Gold
  Panasonic
  supercap
- Place close to 1G32 pin 1
- (in symbol CAP_0) +
- (in symbol SDTitleBlock) Title:; Page Contents:; Revision:; Size:; DWG NO; Date:; Sheet; of

### Library data of the parts
C44 C51 = CAP NP: Part #: 101587-1100R
C45 = CAP NP: Part #: 101587-1101R
C46-C49 = CAP NP_3: Part #: 101103-1184R; SD PCB Footprint: EIA0603
C50 = CAP NP_7: Part #: 101002-1224R
C275 = CAP .1 uF 10% 0603: Part #: 101782-1474R
C607 = CAP_0: .33F 5.5V Gold SD Horizontal Cap.; MfrNum: EEC-S0HD334H; Mfr: Panasonic; PartName: Cap .33F Gold SD 5.5V 20%; Part #: 101056-0335R; TI Footprint: RAD400-400C; Cost10K: 0.616; Cost100: 1.106; VendorNum: P11064-ND; Vendor: Digikey
D21 = MMBD4148_0: Part #: 100185-0001R
R100 = R: Part #: 102598-0002R
R101 R110 R111 = R: Part #: 101370-1003R
R102 = R: Part #: R0402-NOPOP
R103 R106 = R_2: Part #: R0402-NOPOP; SD PCB Footprint: EIA0603
R104 R108 = R: Part #: 101370-0001R; SD PCB Footprint: EIA0603
R105 R109 = R: Part #: R0402-NOPOP; SD PCB Footprint: EIA0603
R107 = R: Part #: 100642-1001R
R112 = R: Part #: 101370-3300R
R113 R114 = R: Part #: 101370-2202R
R396 = R: Part #: 101370-1000R
SW1 = SW - DPDT 5.4x4.2 Slide CAS220A: SLIDE Switch, DPDT,  100mA, J HOOK; MfrNum: CAS-220A; Mfr: BC Components; Part #: 102181-0002R; Vendor: Digi_Key; VendorNum: CAS220JCT-ND; SD PCB Footprint: CAS-220A
U1 = PRIMUS_BGA_1: as U1 on sheet SH12 - OMAP-L137 GND
U20 = 1G032: Part #: 101057-0032R
Y1 = CRYSTAL_0: Part #: 102883-0032R
Y2 = CRYSTAL_0: Part #: 101590-0240R; Spectrum Part#: 101590-0270; SD PCB Footprint: ABM7

## Sheet SH09 - OMAP-L137 EMIF B.SchDoc
size 386 x 246 mm
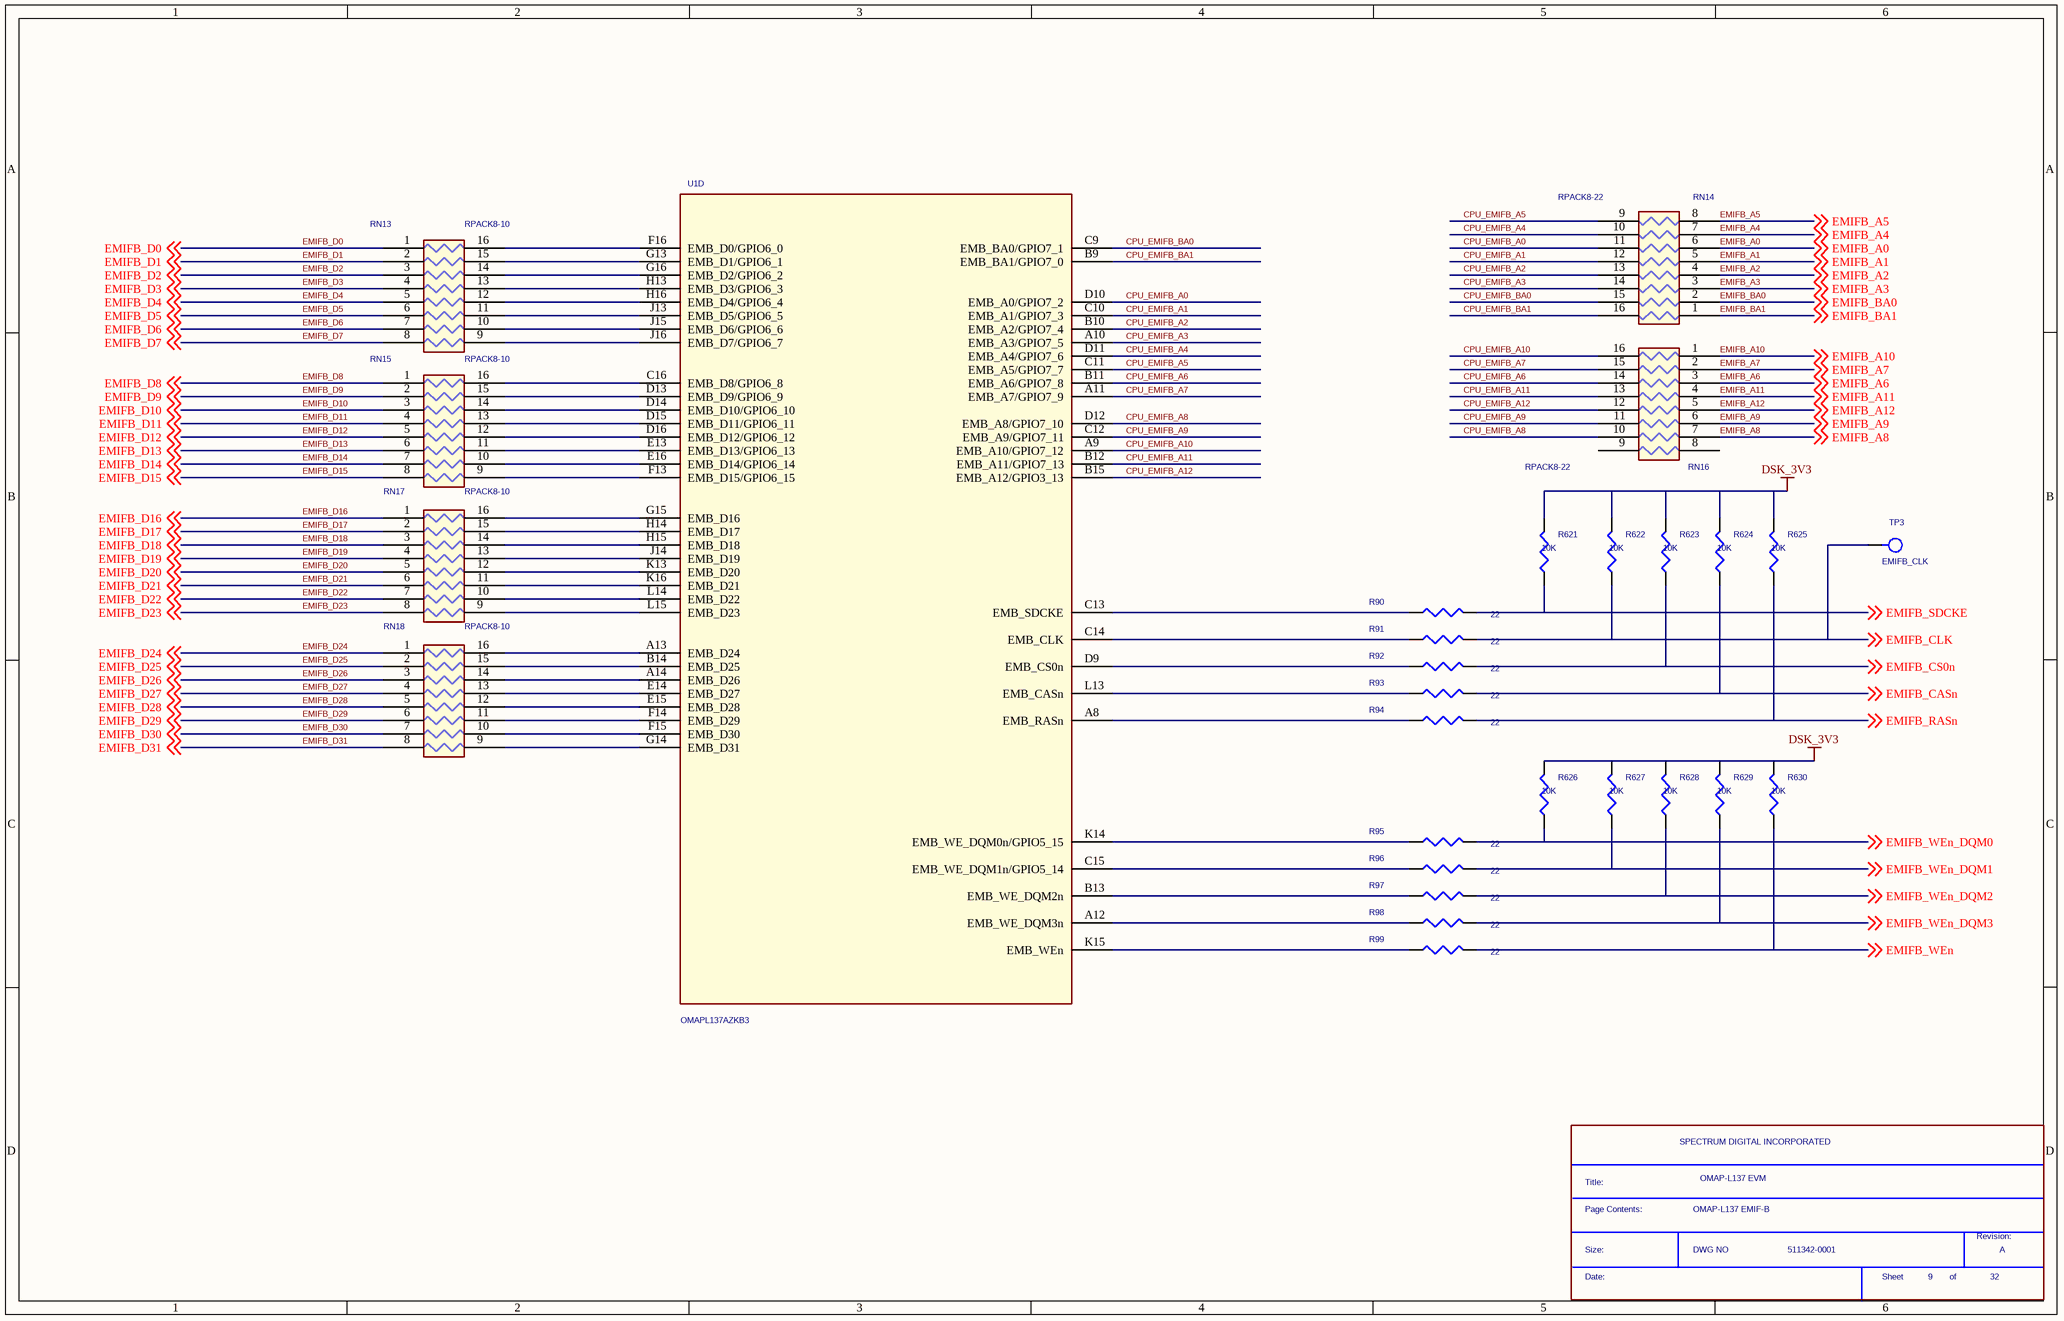
[diagram p23: SH09 - OMAP-L137 EMIF B.SchDoc]

### Parts
(Parts that share a designator on the sheet are numbered #1, #2 ... from top to bottom, then left to right.)
*#24  Page Contents:: OMAP-L137 EMIF-B  RevCode: A  Title: OMAP-L137 EVM  OrgName: SPECTRUM DIGITAL INCORPORATED  Doc: 511342-0001  Page Number: 9  Page Count: 32  (hidden comment: SDTitleBlock)  (graphical)
R90  22  [r402-25]
R91  22  [r402-25]
R92  22  [r402-25]
R93  22  [r402-25]
R94  22  [r402-25]
R95  22  [r402-25]
R96  22  [r402-25]
R97  22  [r402-25]
R98  22  [r402-25]
R99  22  [r402-25]
R621  10K  [r402-25]
R622  10K  [r402-25]
R623  10K  [r402-25]
R624  10K  [r402-25]
R625  10K  [r402-25]
R626  10K  [r402-25]
R627  10K  [r402-25]
R628  10K  [r402-25]
R629  10K  [r402-25]
R630  10K  [r402-25]
RN13  RPACK8-10  [rpak16-10x25-2hv]
RN14  RPACK8-22  [rpak16-10x25-2hv]
RN15  RPACK8-10  [rpak16-10x25-2hv]
RN16  RPACK8-22  [rpak16-10x25-2hv]
RN17  RPACK8-10  [rpak16-10x25-2hv]
RN18  RPACK8-10  [rpak16-10x25-2hv]
TP3  EMIFB_CLK  [tp1-6040]
U1  OMAPL137AZKB3  [skt256-6064]  (part D of 9)

### Nets
DSK_3V3: R621.1 R622.1 R623.1 R624.1 R625.1 R626.1 R627.1 R628.1 R629.1 R630.1
CPU_EMIFB_A0: RN14.11 U1.D10(EMB_A0/GPIO7_2)
CPU_EMIFB_A1: RN14.12 U1.C10(EMB_A1/GPIO7_3)
CPU_EMIFB_A2: RN14.13 U1.B10(EMB_A2/GPIO7_4)
CPU_EMIFB_A3: RN14.14 U1.A10(EMB_A3/GPIO7_5)
CPU_EMIFB_A4: RN14.10 U1.D11(EMB_A4/GPIO7_6)
CPU_EMIFB_A5: RN14.9 U1.C11(EMB_A5/GPIO7_7)
CPU_EMIFB_A6: RN16.14 U1.B11(EMB_A6/GPIO7_8)
CPU_EMIFB_A7: RN16.15 U1.A11(EMB_A7/GPIO7_9)
CPU_EMIFB_A8: RN16.10 U1.D12(EMB_A8/GPIO7_10)
CPU_EMIFB_A9: RN16.11 U1.C12(EMB_A9/GPIO7_11)
CPU_EMIFB_A10: RN16.16 U1.A9(EMB_A10/GPIO7_12)
CPU_EMIFB_A11: RN16.13 U1.B12(EMB_A11/GPIO7_13)
CPU_EMIFB_A12: RN16.12 U1.B15(EMB_A12/GPIO3_13)
CPU_EMIFB_BA0: RN14.15 U1.C9(EMB_BA0/GPIO7_1)
CPU_EMIFB_BA1: RN14.16 U1.B9(EMB_BA1/GPIO7_0)
EMIFB_A0: RN14.6 ; off-sheet EMIFB_A0
EMIFB_A1: RN14.5 ; off-sheet EMIFB_A1
EMIFB_A2: RN14.4 ; off-sheet EMIFB_A2
EMIFB_A3: RN14.3 ; off-sheet EMIFB_A3
EMIFB_A4: RN14.7 ; off-sheet EMIFB_A4
EMIFB_A5: RN14.8 ; off-sheet EMIFB_A5
EMIFB_A6: RN16.3 ; off-sheet EMIFB_A6
EMIFB_A7: RN16.2 ; off-sheet EMIFB_A7
EMIFB_A8: RN16.7 ; off-sheet EMIFB_A8
EMIFB_A9: RN16.6 ; off-sheet EMIFB_A9
EMIFB_A10: RN16.1 ; off-sheet EMIFB_A10
EMIFB_A11: RN16.4 ; off-sheet EMIFB_A11
EMIFB_A12: RN16.5 ; off-sheet EMIFB_A12
EMIFB_BA0: RN14.2 ; off-sheet EMIFB_BA0
EMIFB_BA1: RN14.1 ; off-sheet EMIFB_BA1
EMIFB_CASn: R93.1 R624.2 ; off-sheet EMIFB_CASn
EMIFB_CLK: R91.1 R622.2 TP3.1(PIN) ; off-sheet EMIFB_CLK
EMIFB_CS0n: R92.1 R623.2 ; off-sheet EMIFB_CS0n
EMIFB_D0: RN13.1 ; off-sheet EMIFB_D0
EMIFB_D1: RN13.2 ; off-sheet EMIFB_D1
EMIFB_D2: RN13.3 ; off-sheet EMIFB_D2
EMIFB_D3: RN13.4 ; off-sheet EMIFB_D3
EMIFB_D4: RN13.5 ; off-sheet EMIFB_D4
EMIFB_D5: RN13.6 ; off-sheet EMIFB_D5
EMIFB_D6: RN13.7 ; off-sheet EMIFB_D6
EMIFB_D7: RN13.8 ; off-sheet EMIFB_D7
EMIFB_D8: RN15.1 ; off-sheet EMIFB_D8
EMIFB_D9: RN15.2 ; off-sheet EMIFB_D9
EMIFB_D10: RN15.3 ; off-sheet EMIFB_D10
EMIFB_D11: RN15.4 ; off-sheet EMIFB_D11
EMIFB_D12: RN15.5 ; off-sheet EMIFB_D12
EMIFB_D13: RN15.6 ; off-sheet EMIFB_D13
EMIFB_D14: RN15.7 ; off-sheet EMIFB_D14
EMIFB_D15: RN15.8 ; off-sheet EMIFB_D15
EMIFB_D16: RN17.1 ; off-sheet EMIFB_D16
EMIFB_D17: RN17.2 ; off-sheet EMIFB_D17
EMIFB_D18: RN17.3 ; off-sheet EMIFB_D18
EMIFB_D19: RN17.4 ; off-sheet EMIFB_D19
EMIFB_D20: RN17.5 ; off-sheet EMIFB_D20
EMIFB_D21: RN17.6 ; off-sheet EMIFB_D21
EMIFB_D22: RN17.7 ; off-sheet EMIFB_D22
EMIFB_D23: RN17.8 ; off-sheet EMIFB_D23
EMIFB_D24: RN18.1 ; off-sheet EMIFB_D24
EMIFB_D25: RN18.2 ; off-sheet EMIFB_D25
EMIFB_D26: RN18.3 ; off-sheet EMIFB_D26
EMIFB_D27: RN18.4 ; off-sheet EMIFB_D27
EMIFB_D28: RN18.5 ; off-sheet EMIFB_D28
EMIFB_D29: RN18.6 ; off-sheet EMIFB_D29
EMIFB_D30: RN18.7 ; off-sheet EMIFB_D30
EMIFB_D31: RN18.8 ; off-sheet EMIFB_D31
EMIFB_RASn: R94.1 R625.2 ; off-sheet EMIFB_RASn
EMIFB_SDCKE: R90.1 R621.2 ; off-sheet EMIFB_SDCKE
EMIFB_WEn: R99.1 R630.2 ; off-sheet EMIFB_WEn
EMIFB_WEn_DQM0: R95.1 R626.2 ; off-sheet EMIFB_WEn_DQM0
EMIFB_WEn_DQM1: R96.1 R627.2 ; off-sheet EMIFB_WEn_DQM1
EMIFB_WEn_DQM2: R97.1 R628.2 ; off-sheet EMIFB_WEn_DQM2
EMIFB_WEn_DQM3: R98.1 R629.2 ; off-sheet EMIFB_WEn_DQM3
NetR90_2: R90.2 U1.C13(EMB_SDCKE)
NetR91_2: R91.2 U1.C14(EMB_CLK)
NetR92_2: R92.2 U1.D9(EMB_CS0n)
NetR93_2: R93.2 U1.L13(EMB_CASn)
NetR94_2: R94.2 U1.A8(EMB_RASn)
NetR95_2: R95.2 U1.K14(EMB_WE_DQM0n/GPIO5_15)
NetR96_2: R96.2 U1.C15(EMB_WE_DQM1n/GPIO5_14)
NetR97_2: R97.2 U1.B13(EMB_WE_DQM2n)
NetR98_2: R98.2 U1.A12(EMB_WE_DQM3n)
NetR99_2: R99.2 U1.K15(EMB_WEn)
NetRN13_9: RN13.9 U1.J16(EMB_D7/GPIO6_7)
NetRN13_10: RN13.10 U1.J15(EMB_D6/GPIO6_6)
NetRN13_11: RN13.11 U1.J13(EMB_D5/GPIO6_5)
NetRN13_12: RN13.12 U1.H16(EMB_D4/GPIO6_4)
NetRN13_13: RN13.13 U1.H13(EMB_D3/GPIO6_3)
NetRN13_14: RN13.14 U1.G16(EMB_D2/GPIO6_2)
NetRN13_15: RN13.15 U1.G13(EMB_D1/GPIO6_1)
NetRN13_16: RN13.16 U1.F16(EMB_D0/GPIO6_0)
NetRN15_9: RN15.9 U1.F13(EMB_D15/GPIO6_15)
NetRN15_10: RN15.10 U1.E16(EMB_D14/GPIO6_14)
NetRN15_11: RN15.11 U1.E13(EMB_D13/GPIO6_13)
NetRN15_12: RN15.12 U1.D16(EMB_D12/GPIO6_12)
NetRN15_13: RN15.13 U1.D15(EMB_D11/GPIO6_11)
NetRN15_14: RN15.14 U1.D14(EMB_D10/GPIO6_10)
NetRN15_15: RN15.15 U1.D13(EMB_D9/GPIO6_9)
NetRN15_16: RN15.16 U1.C16(EMB_D8/GPIO6_8)
NetRN17_9: RN17.9 U1.L15(EMB_D23)
NetRN17_10: RN17.10 U1.L14(EMB_D22)
NetRN17_11: RN17.11 U1.K16(EMB_D21)
NetRN17_12: RN17.12 U1.K13(EMB_D20)
NetRN17_13: RN17.13 U1.J14(EMB_D19)
NetRN17_14: RN17.14 U1.H15(EMB_D18)
NetRN17_15: RN17.15 U1.H14(EMB_D17)
NetRN17_16: RN17.16 U1.G15(EMB_D16)
NetRN18_9: RN18.9 U1.G14(EMB_D31)
NetRN18_10: RN18.10 U1.F15(EMB_D30)
NetRN18_11: RN18.11 U1.F14(EMB_D29)
NetRN18_12: RN18.12 U1.E15(EMB_D28)
NetRN18_13: RN18.13 U1.E14(EMB_D27)
NetRN18_14: RN18.14 U1.A14(EMB_D26)
NetRN18_15: RN18.15 U1.B14(EMB_D25)
NetRN18_16: RN18.16 U1.A13(EMB_D24)

Not connected (* = marked no-connect by the designer): RN16 8 9

### Notes on the sheet
- (in symbol SDTitleBlock) Title:; Page Contents:; Revision:; Size:; DWG NO; Date:; Sheet; of

### Library data of the parts
R90-R99 = R_0: Part #: 101370-2200R
R621-R630 = R: Part #: 101370-1003R
RN13 RN15 RN17 RN18 = RESISTOR DIP 8_0: Part #: 101069-1000R
RN14 RN16 = RESISTOR DIP 8_0: Part #: 101069-2200R
TP3 = Test Point_1: Test Point; PartName: HEADER 1; Vendor: Digi-Key; Vendor Nbr: S2111-36-ND
U1 = PRIMUS_BGA_1: as U1 on sheet SH12 - OMAP-L137 GND